# EasyEDA schematic Talos ES™ CTRL Schematics.json

## Sheets
1 FETCH: TITLE: Talos ES™ CTRL, fetch; REV: 1.0; Date: 2022-12-02; Sheet: 1/6; Drawn By: Bernardo Kastrup; Company: The Byte Attic
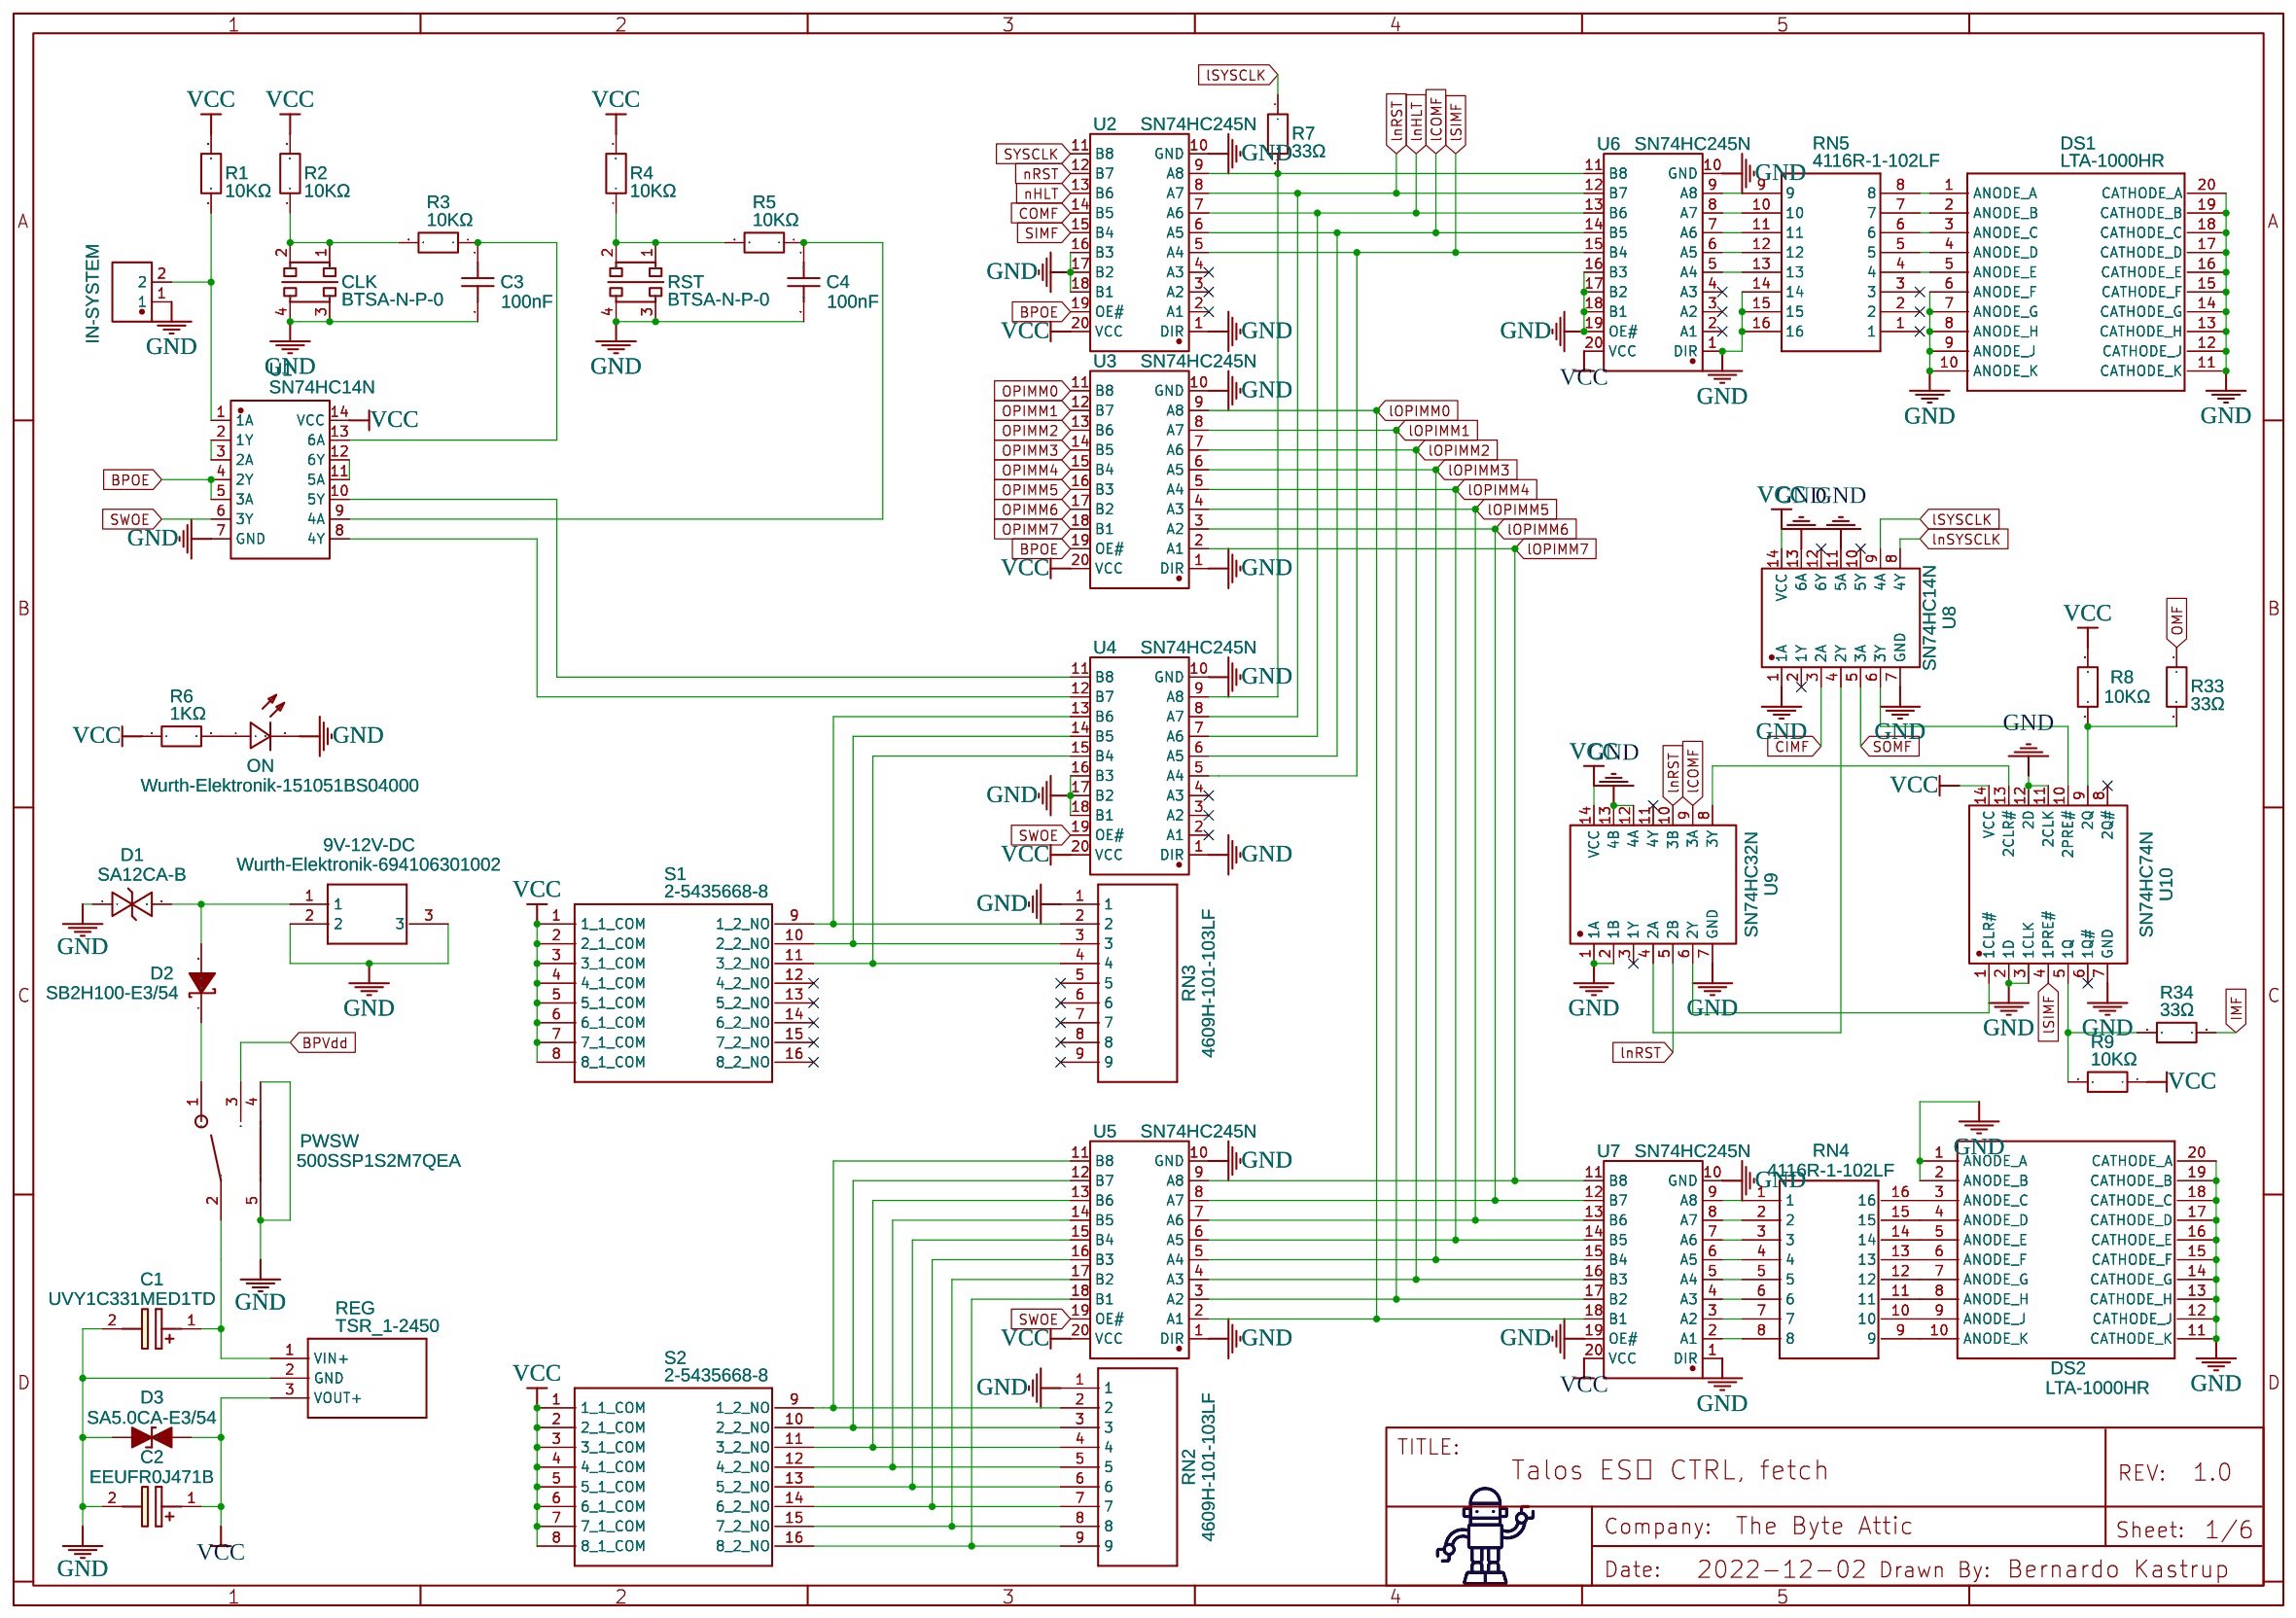
[diagram p0: FETCH]
2 HALT: TITLE: Talos ES™ CTRL, halt circuitry; Sheet: 2/6
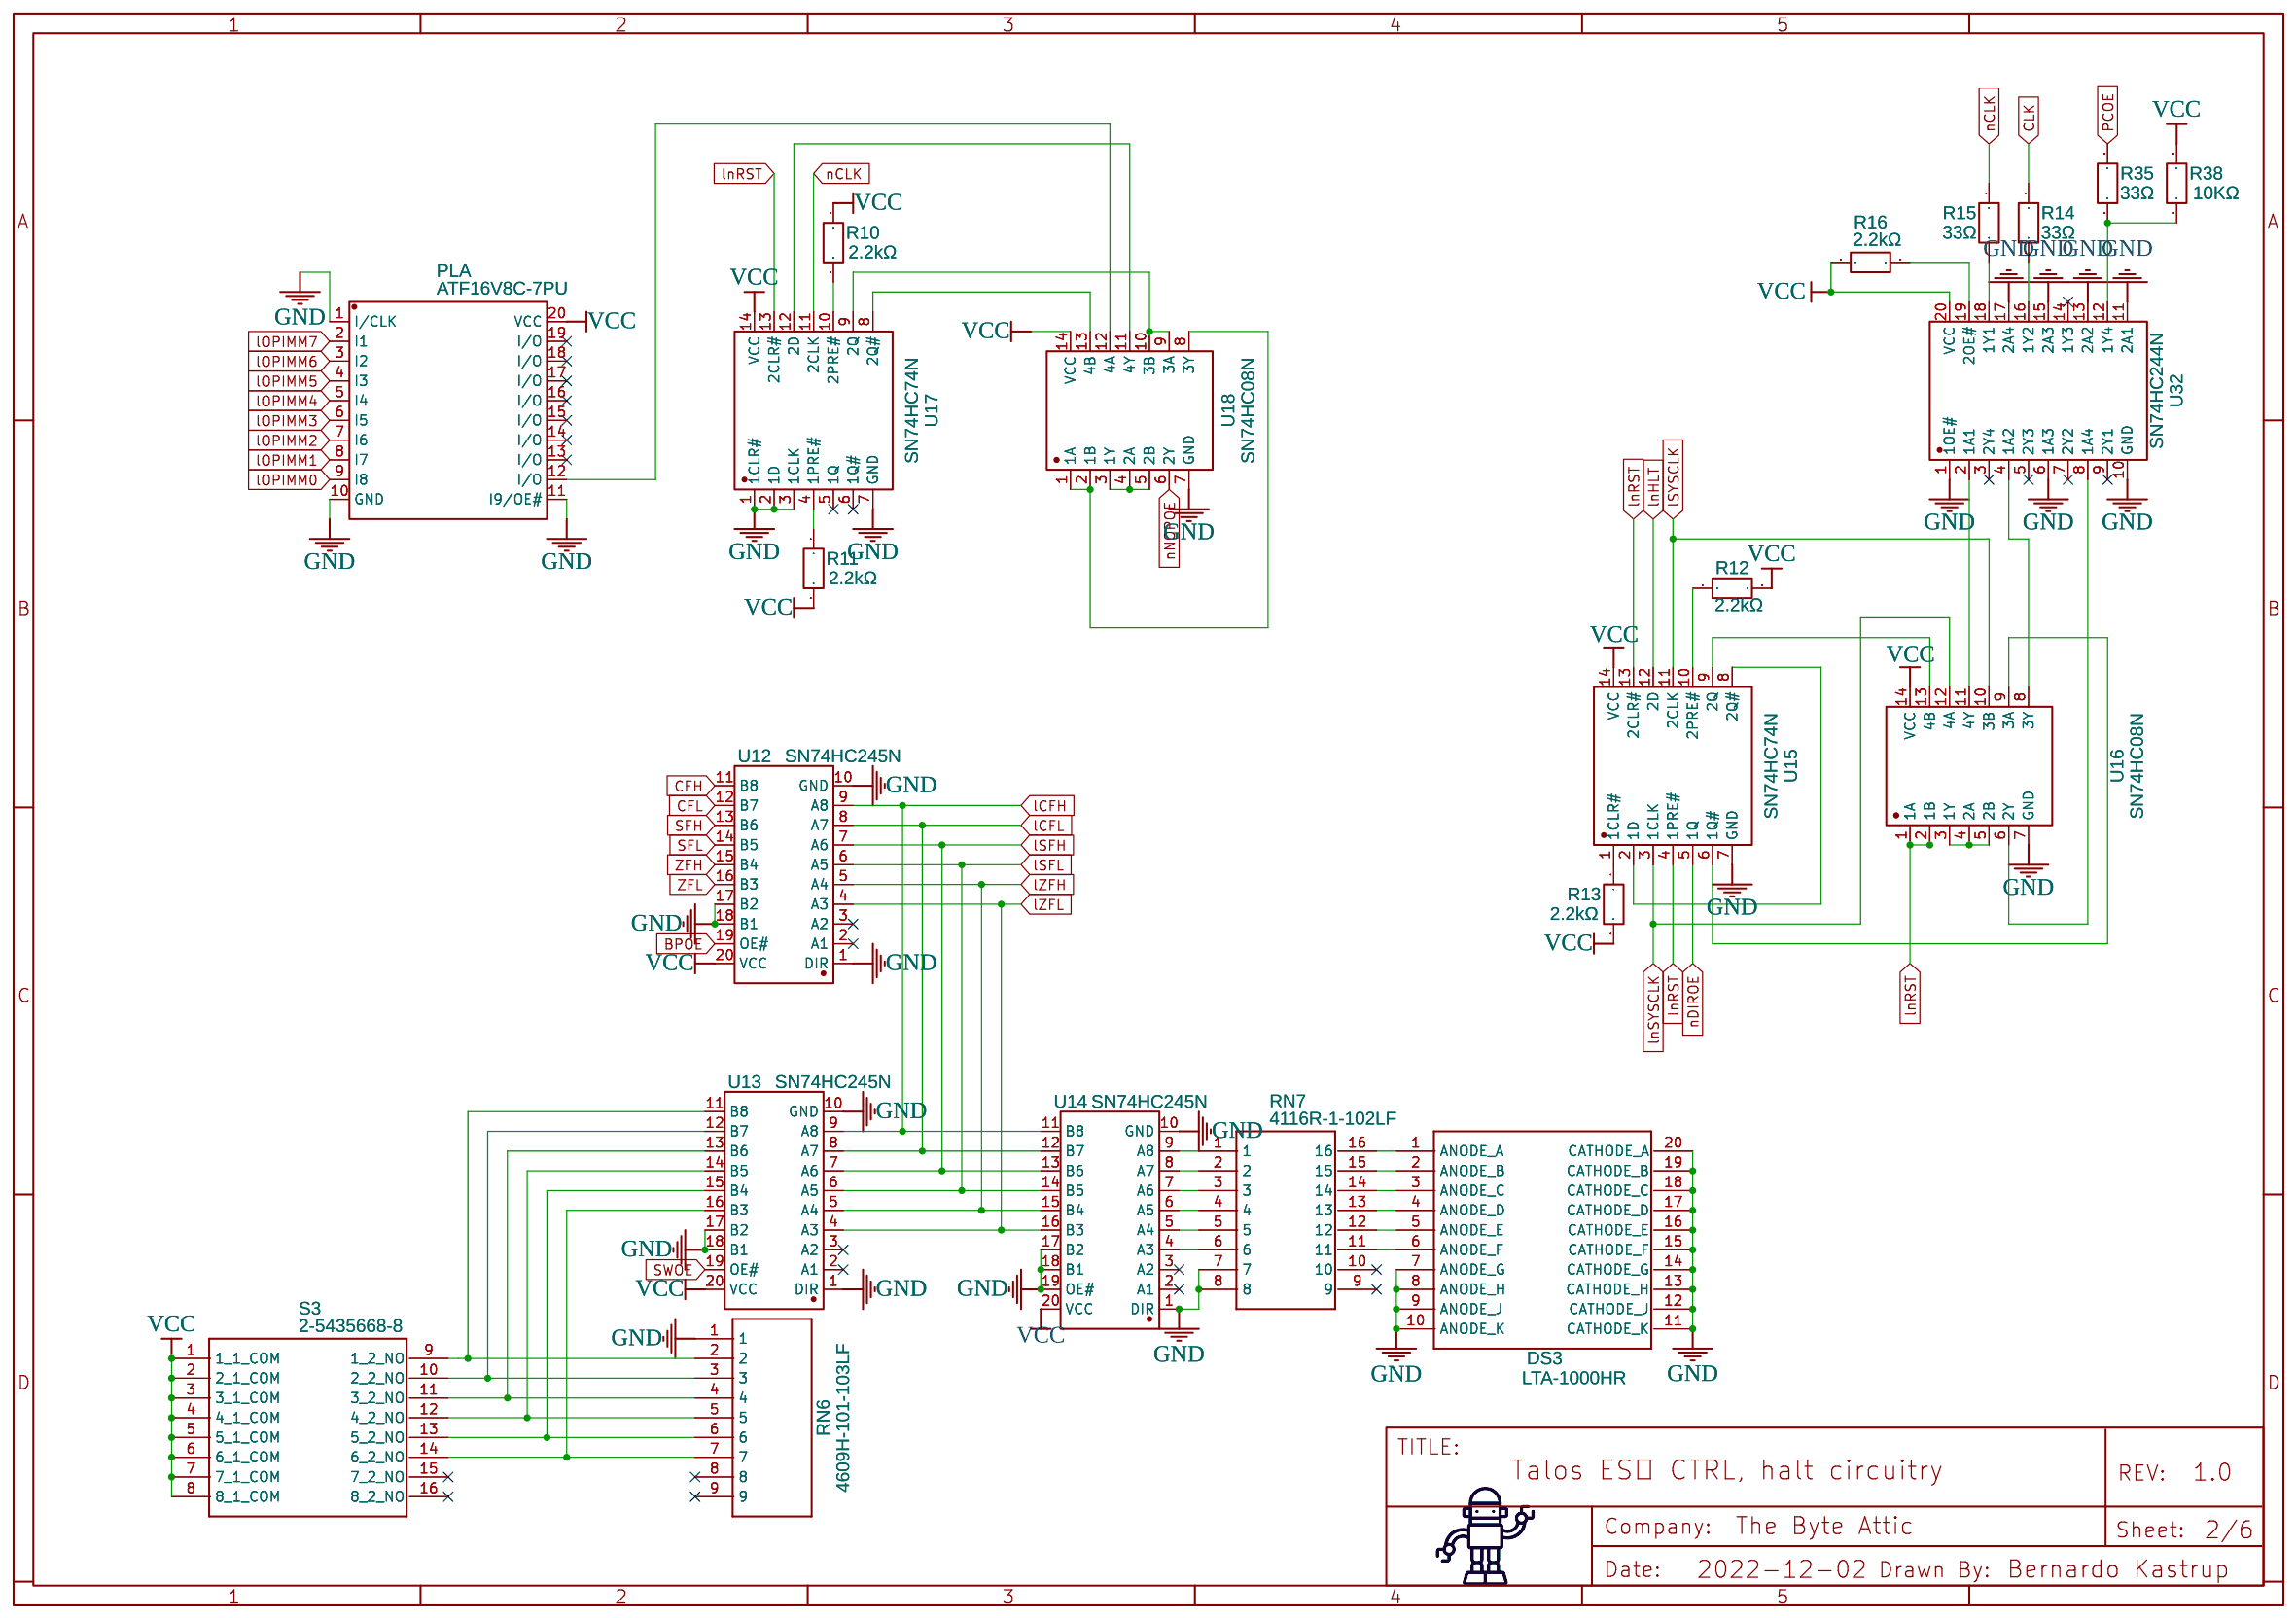
[diagram p1: HALT]
3 DECODE: TITLE: Talos ES™ CTRL, decode; Sheet: 3/6
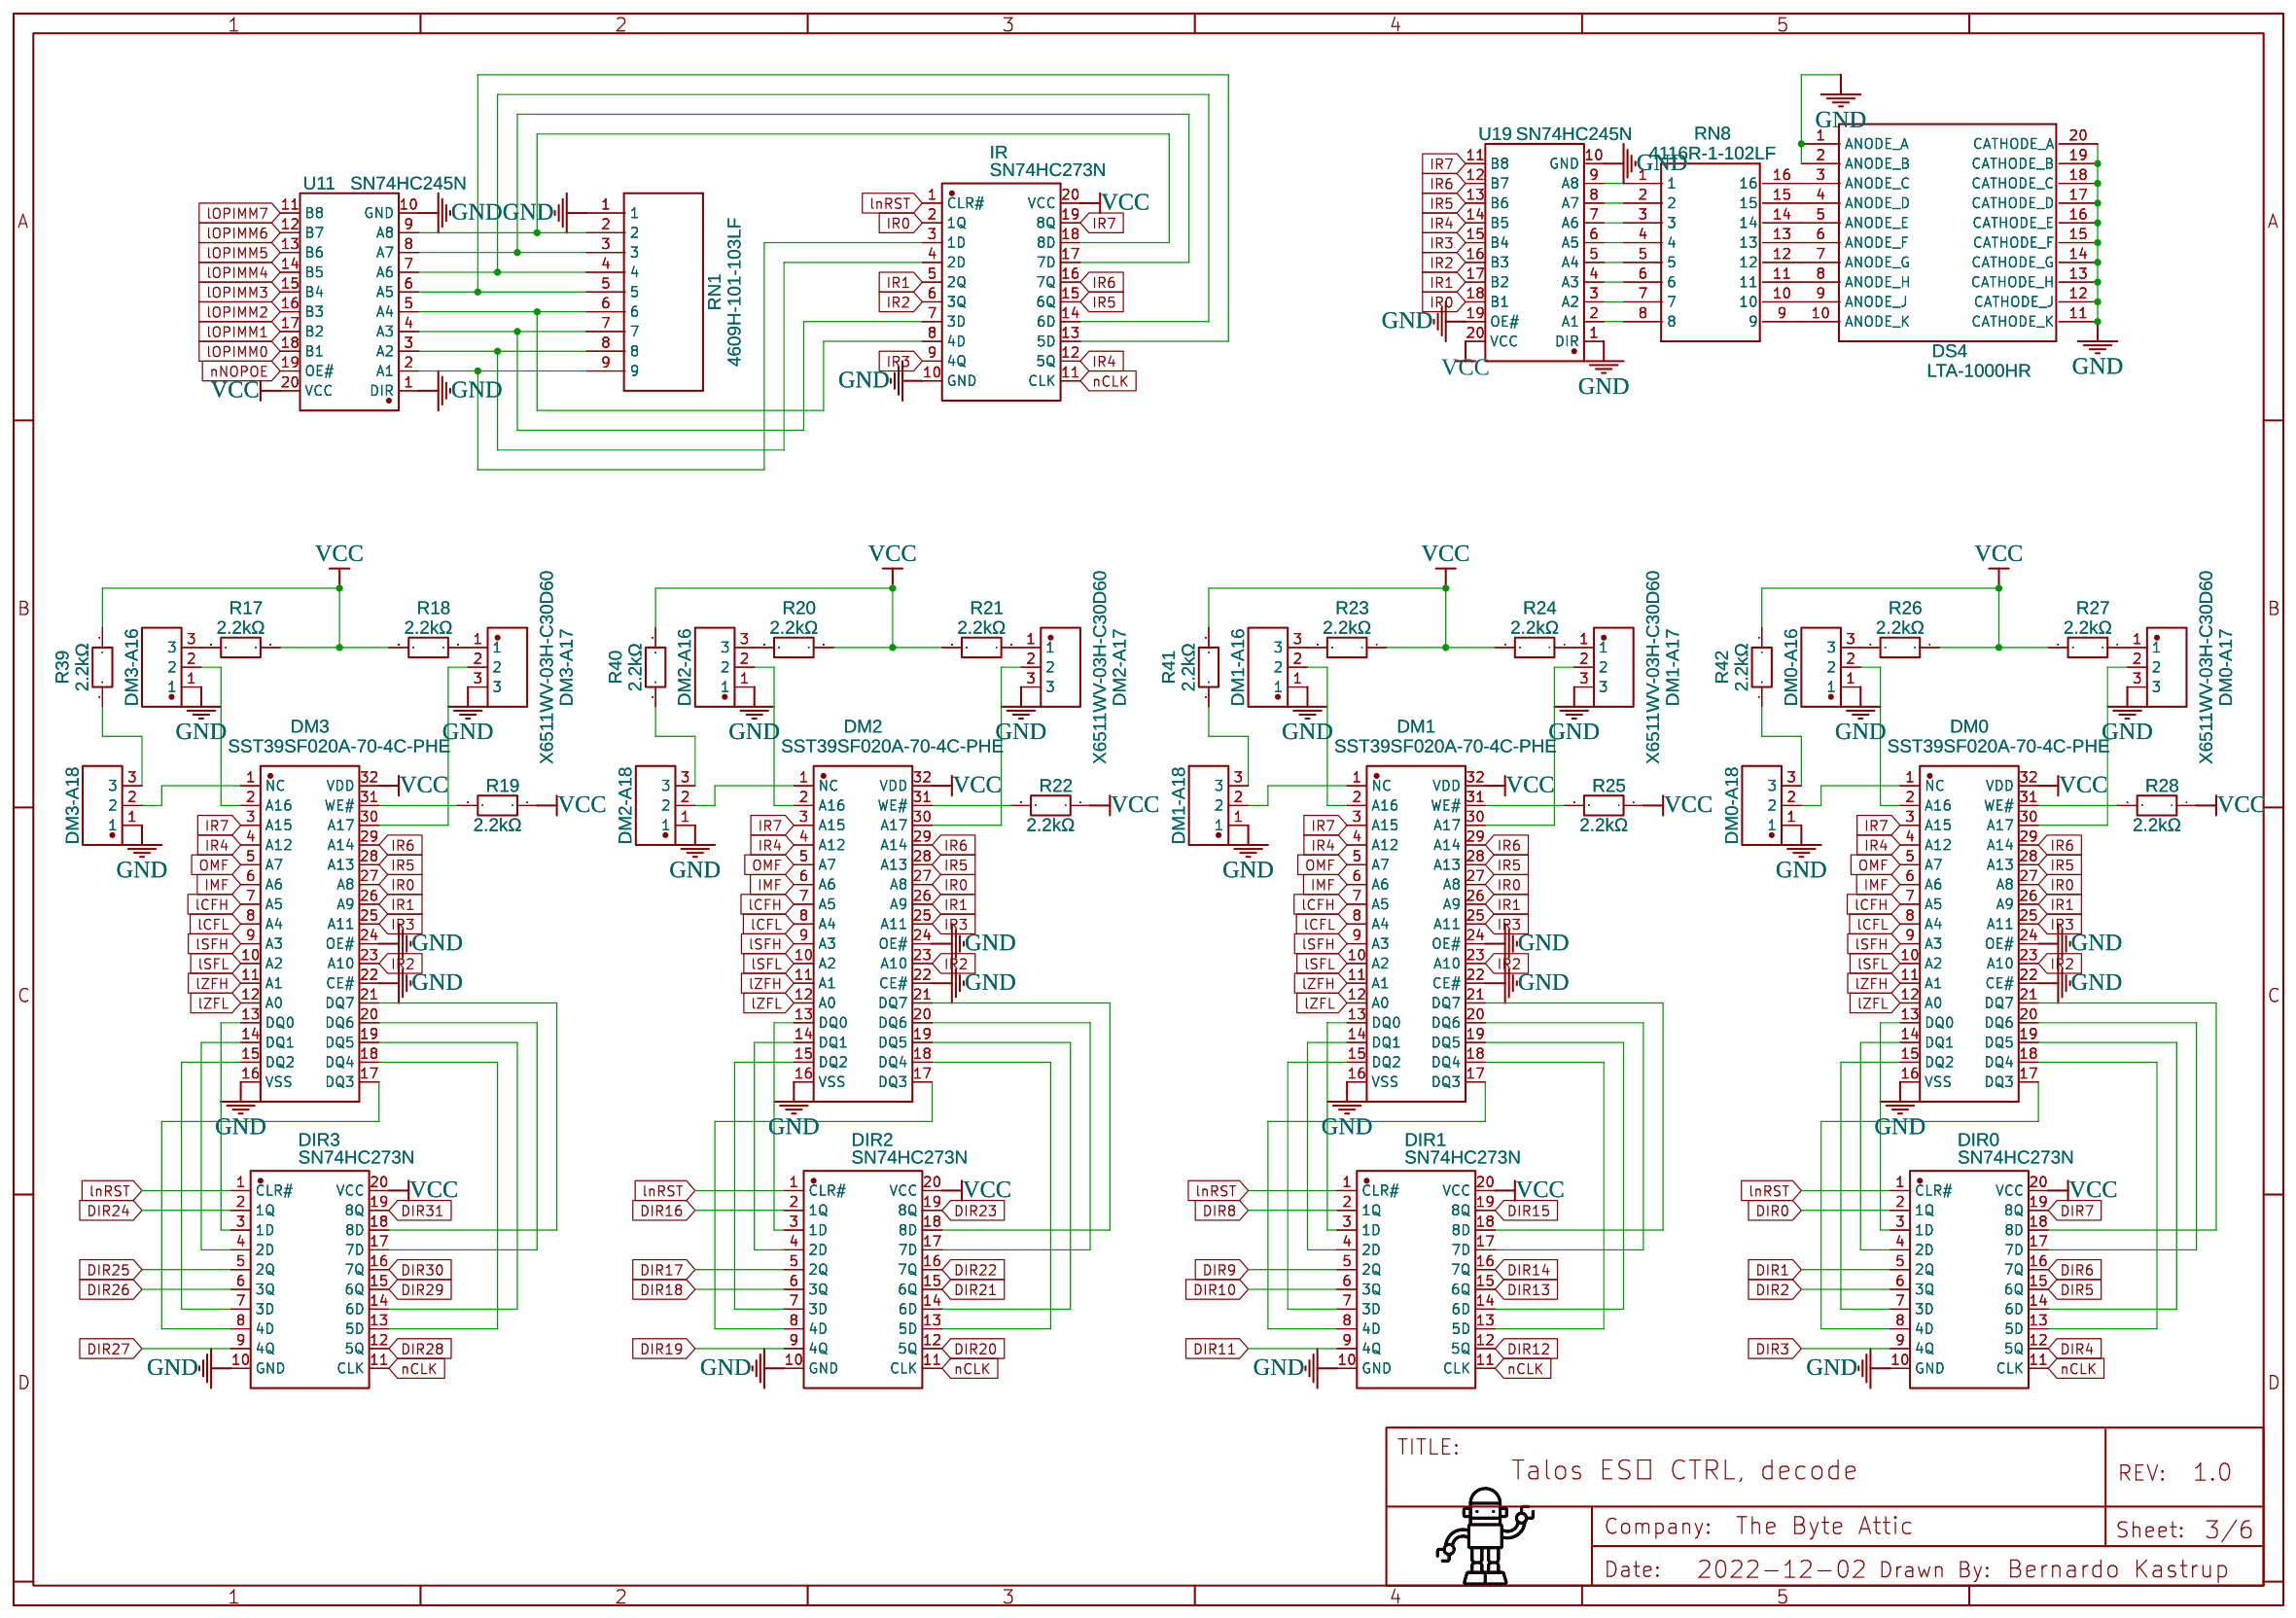
[diagram p2: DECODE]
4 EXECUTE: TITLE: Talos ES™ CTRL, execute; Sheet: 4/6
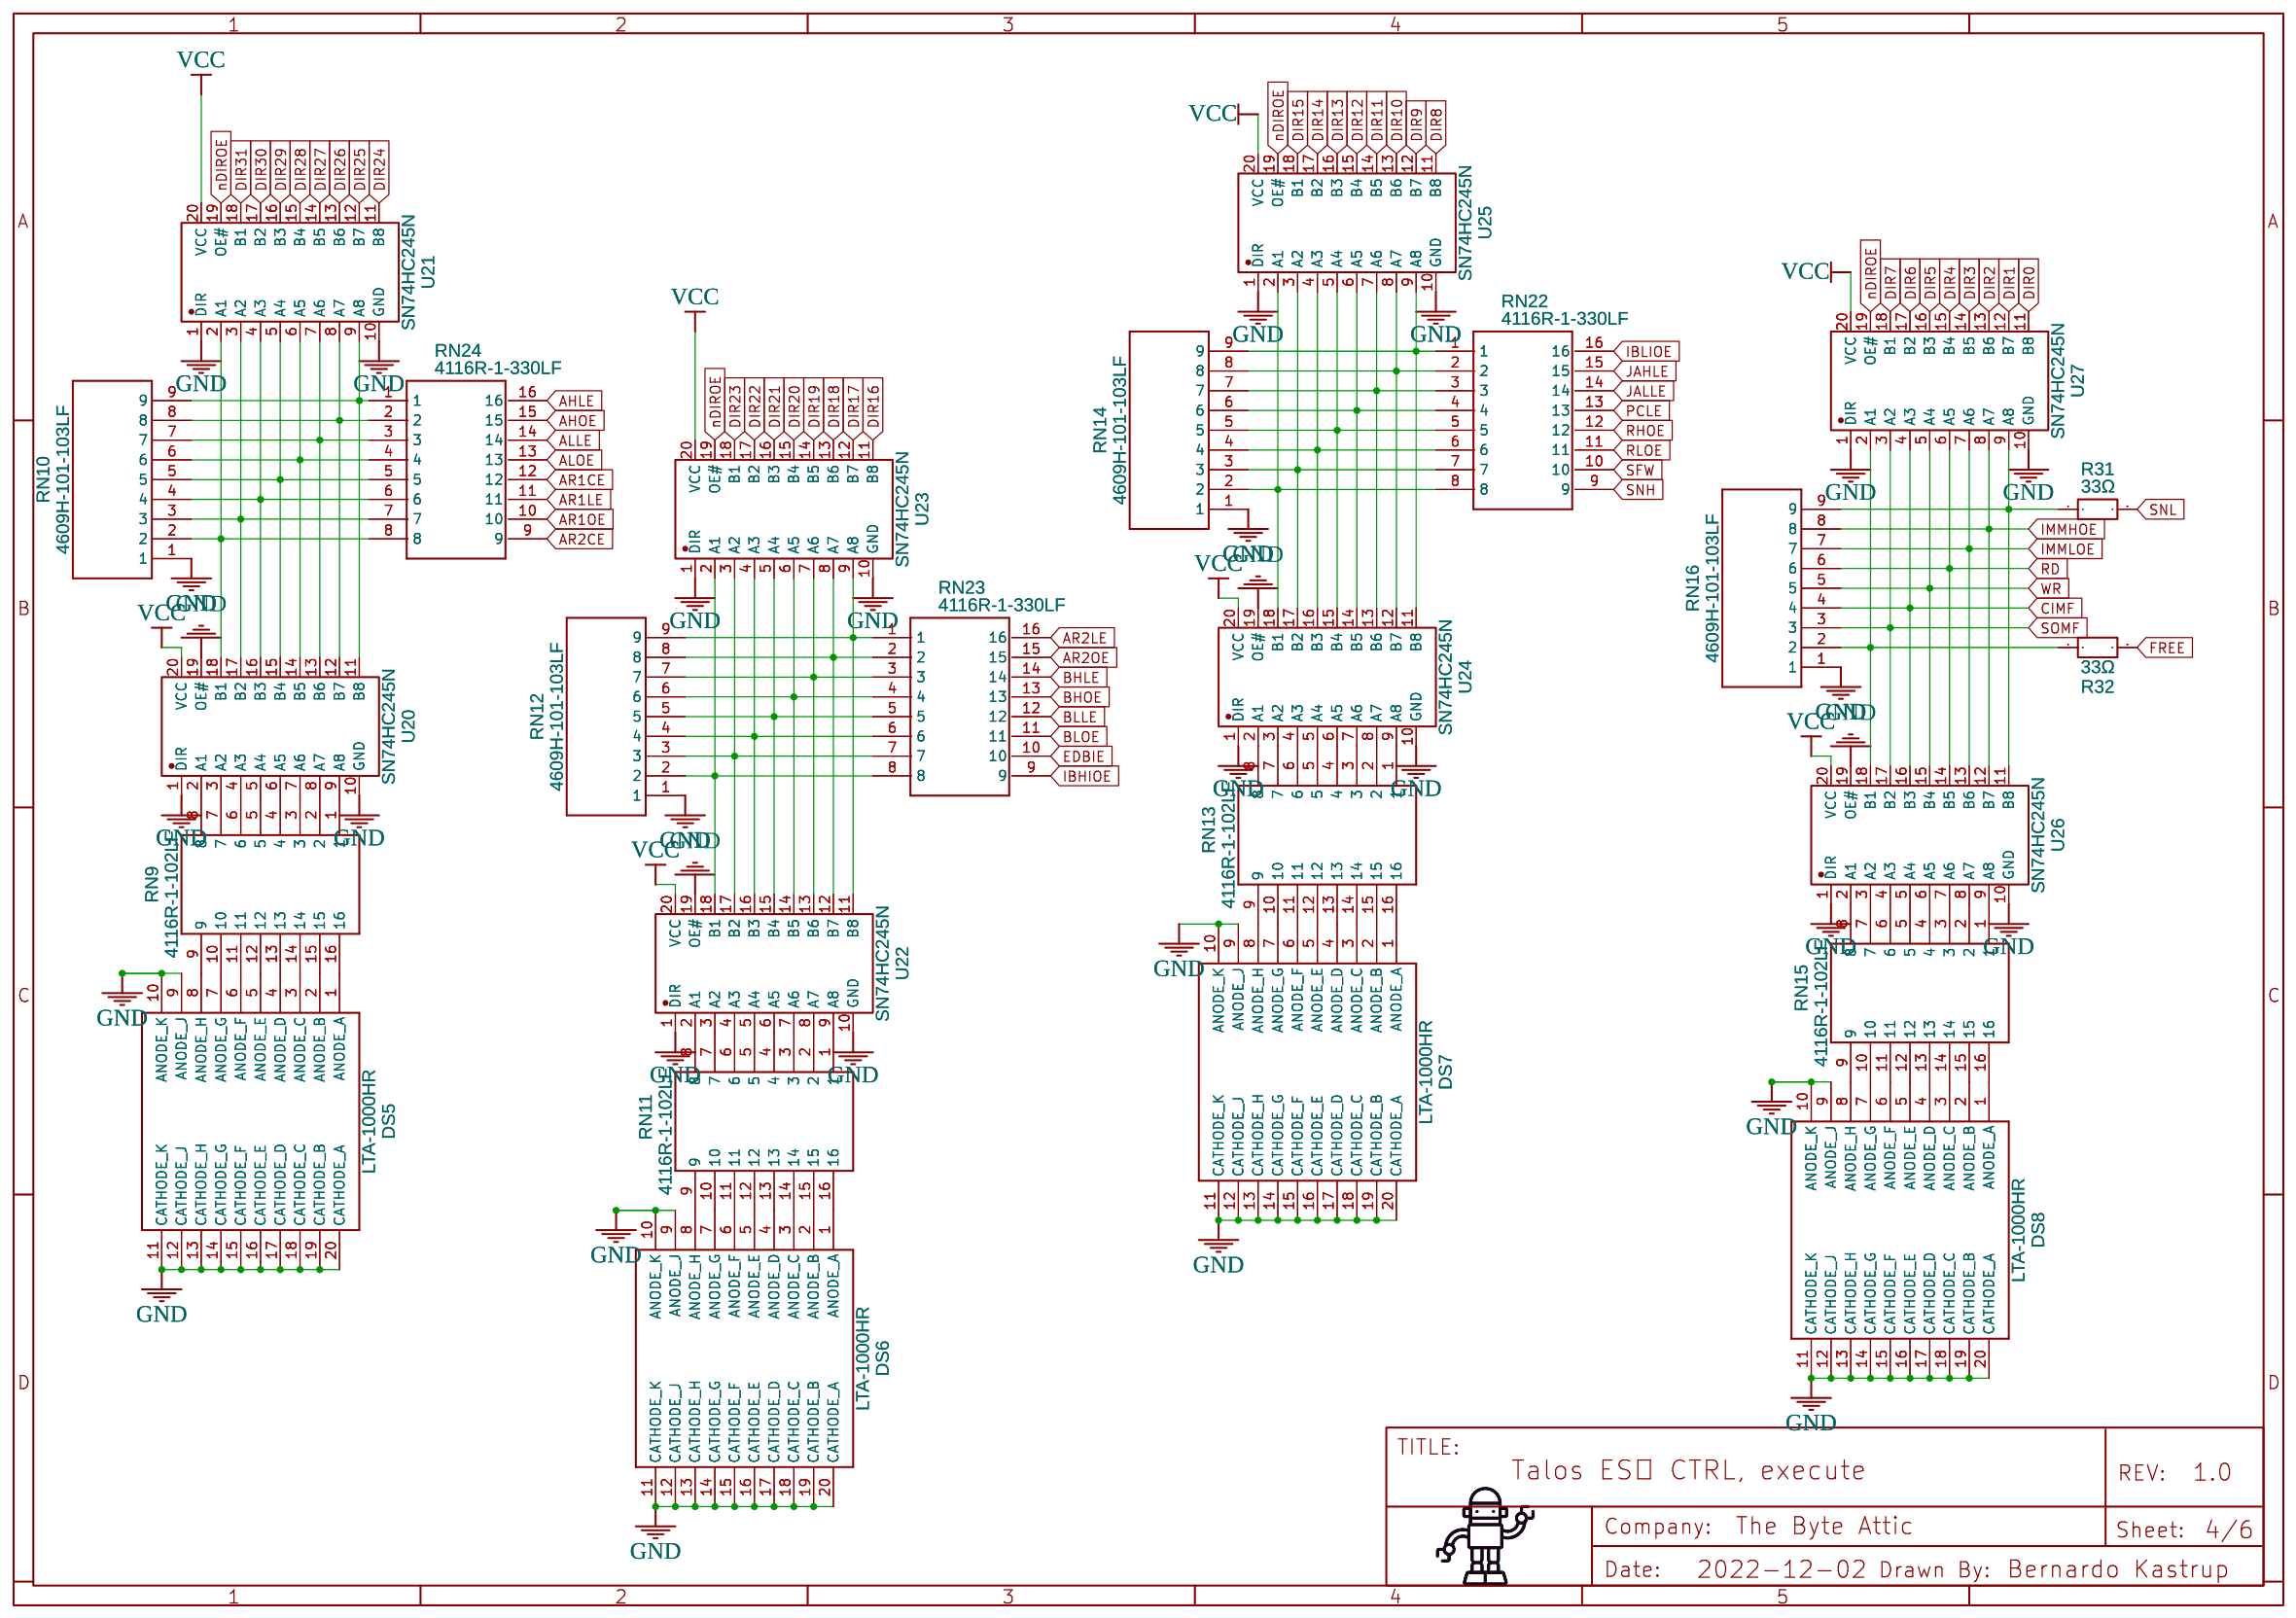
[diagram p3: EXECUTE]
5 IMMEDIATE: TITLE: Talos ES™ CTRL, immediate handling; Sheet: 5/6
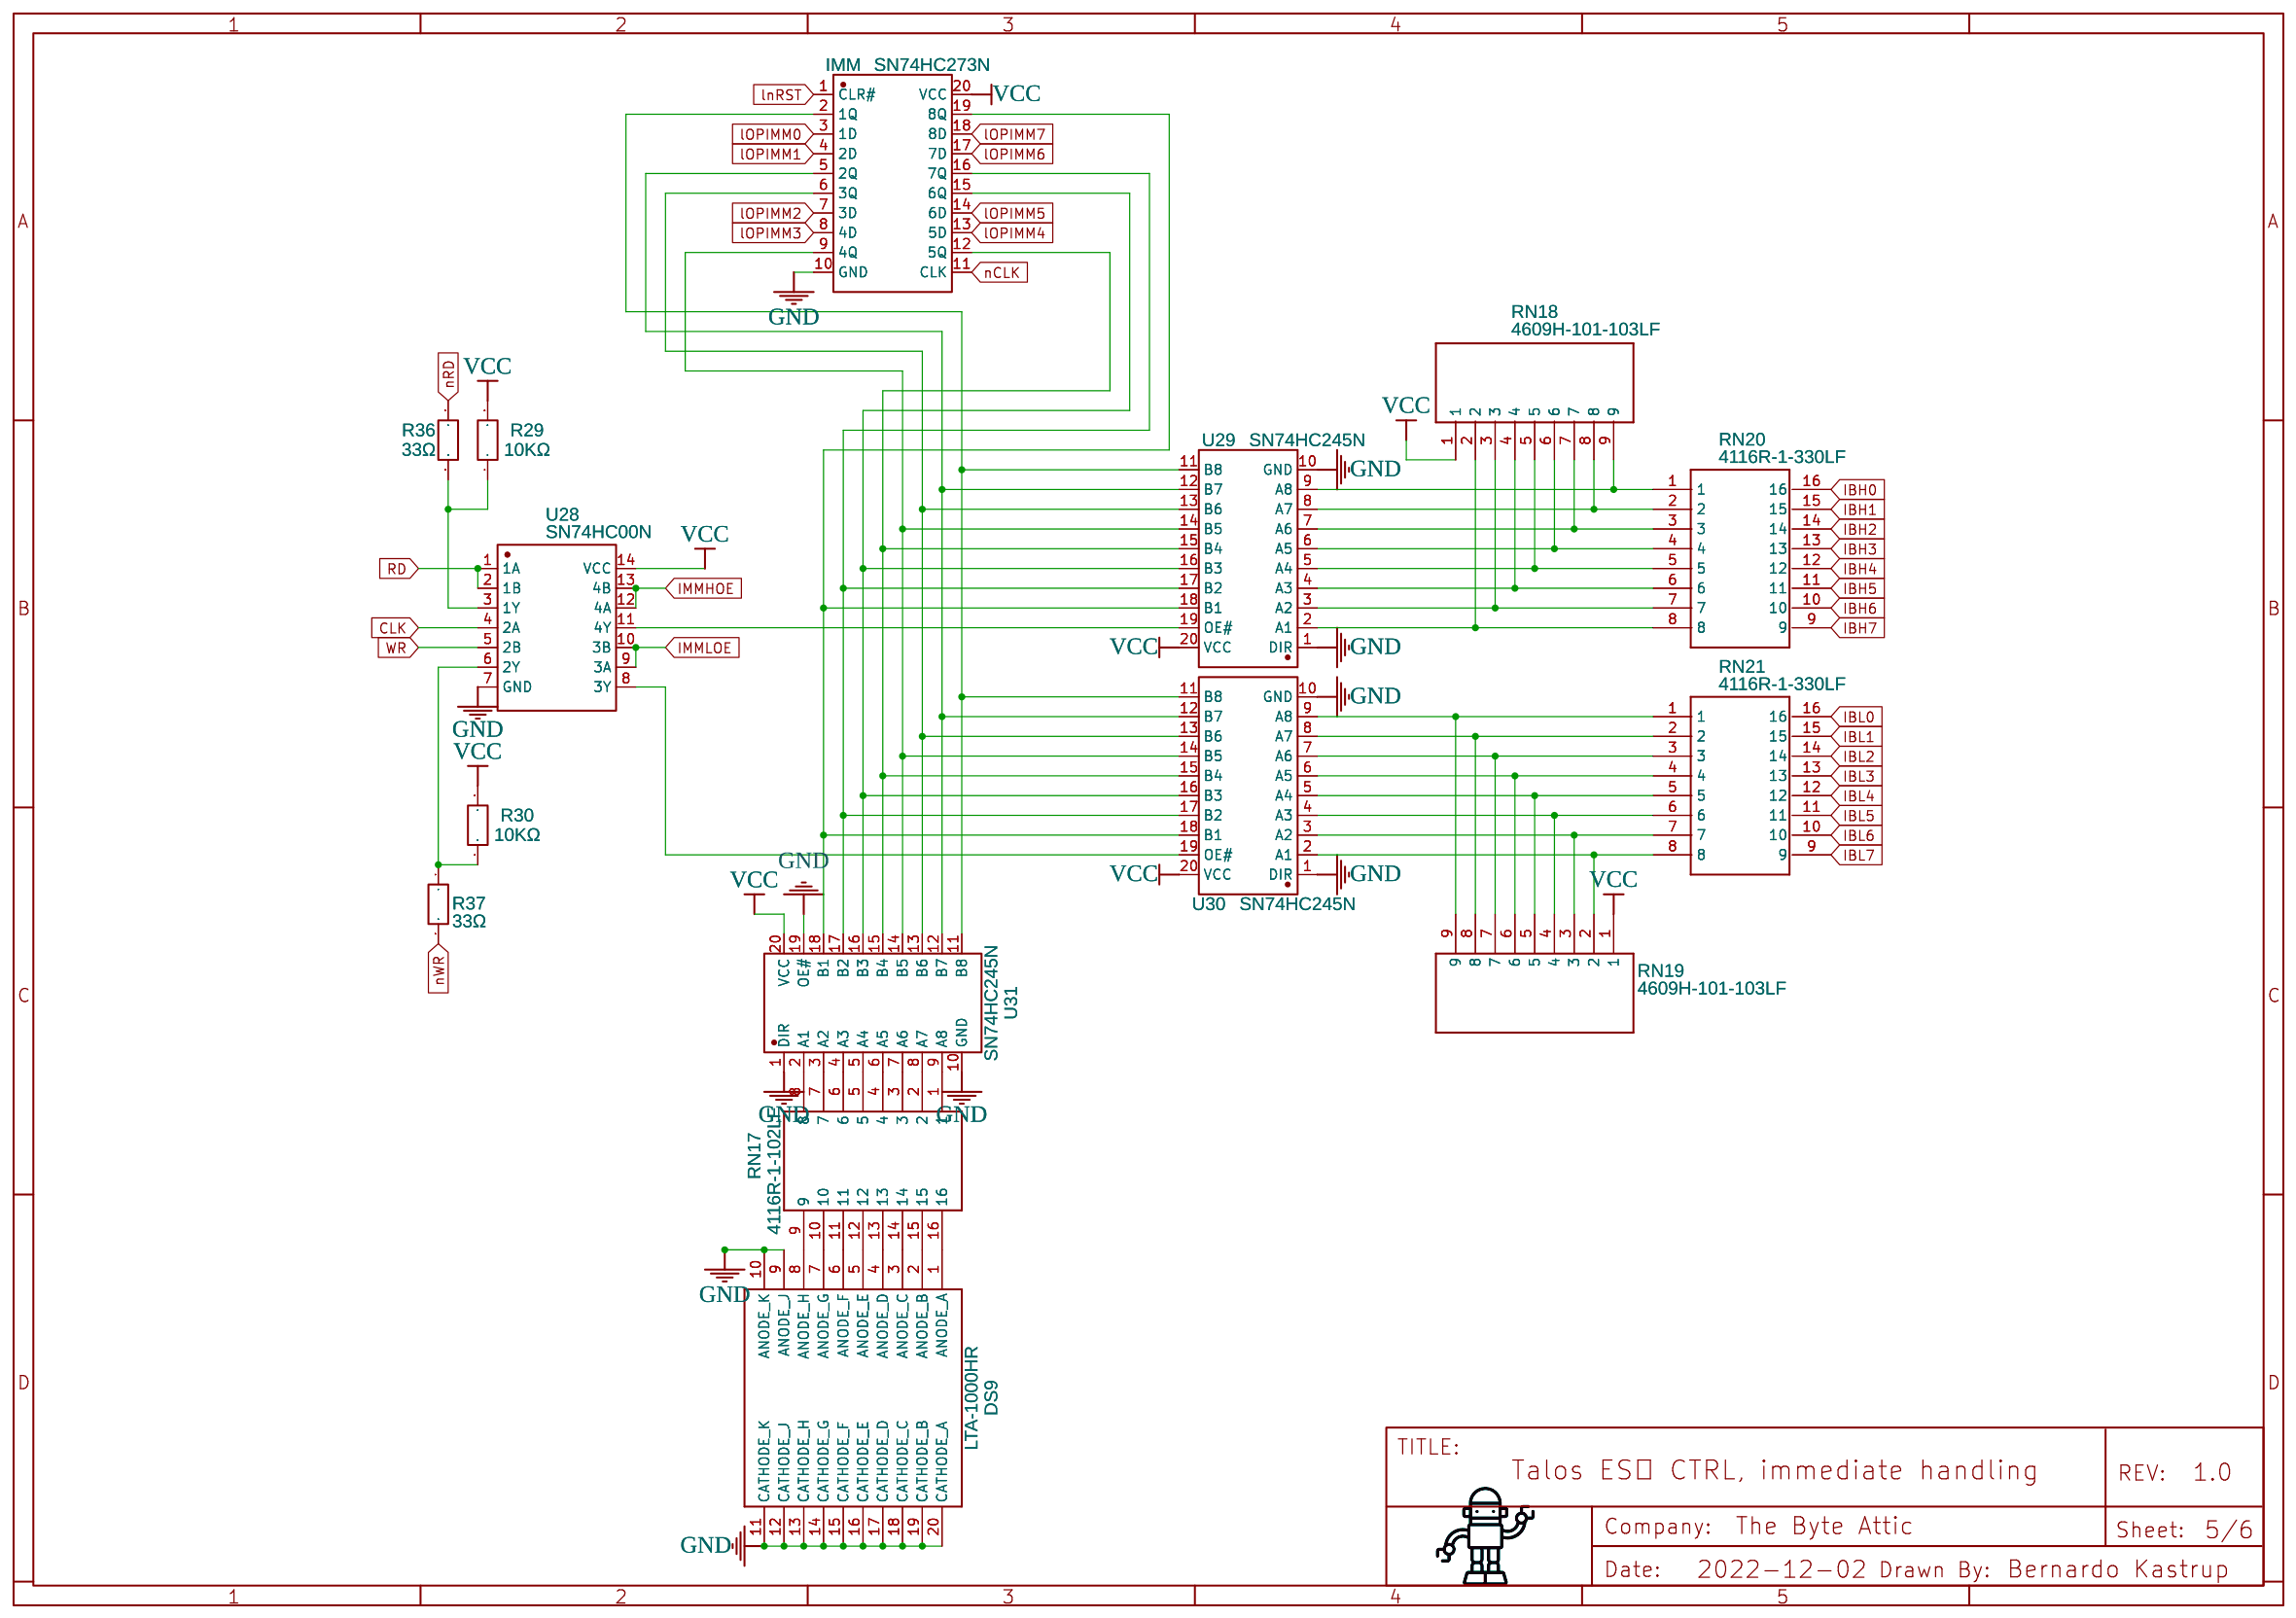
[diagram p4: IMMEDIATE]
6 I/O: TITLE: Talos ES™ CTRL, I/Os; Sheet: 6/6
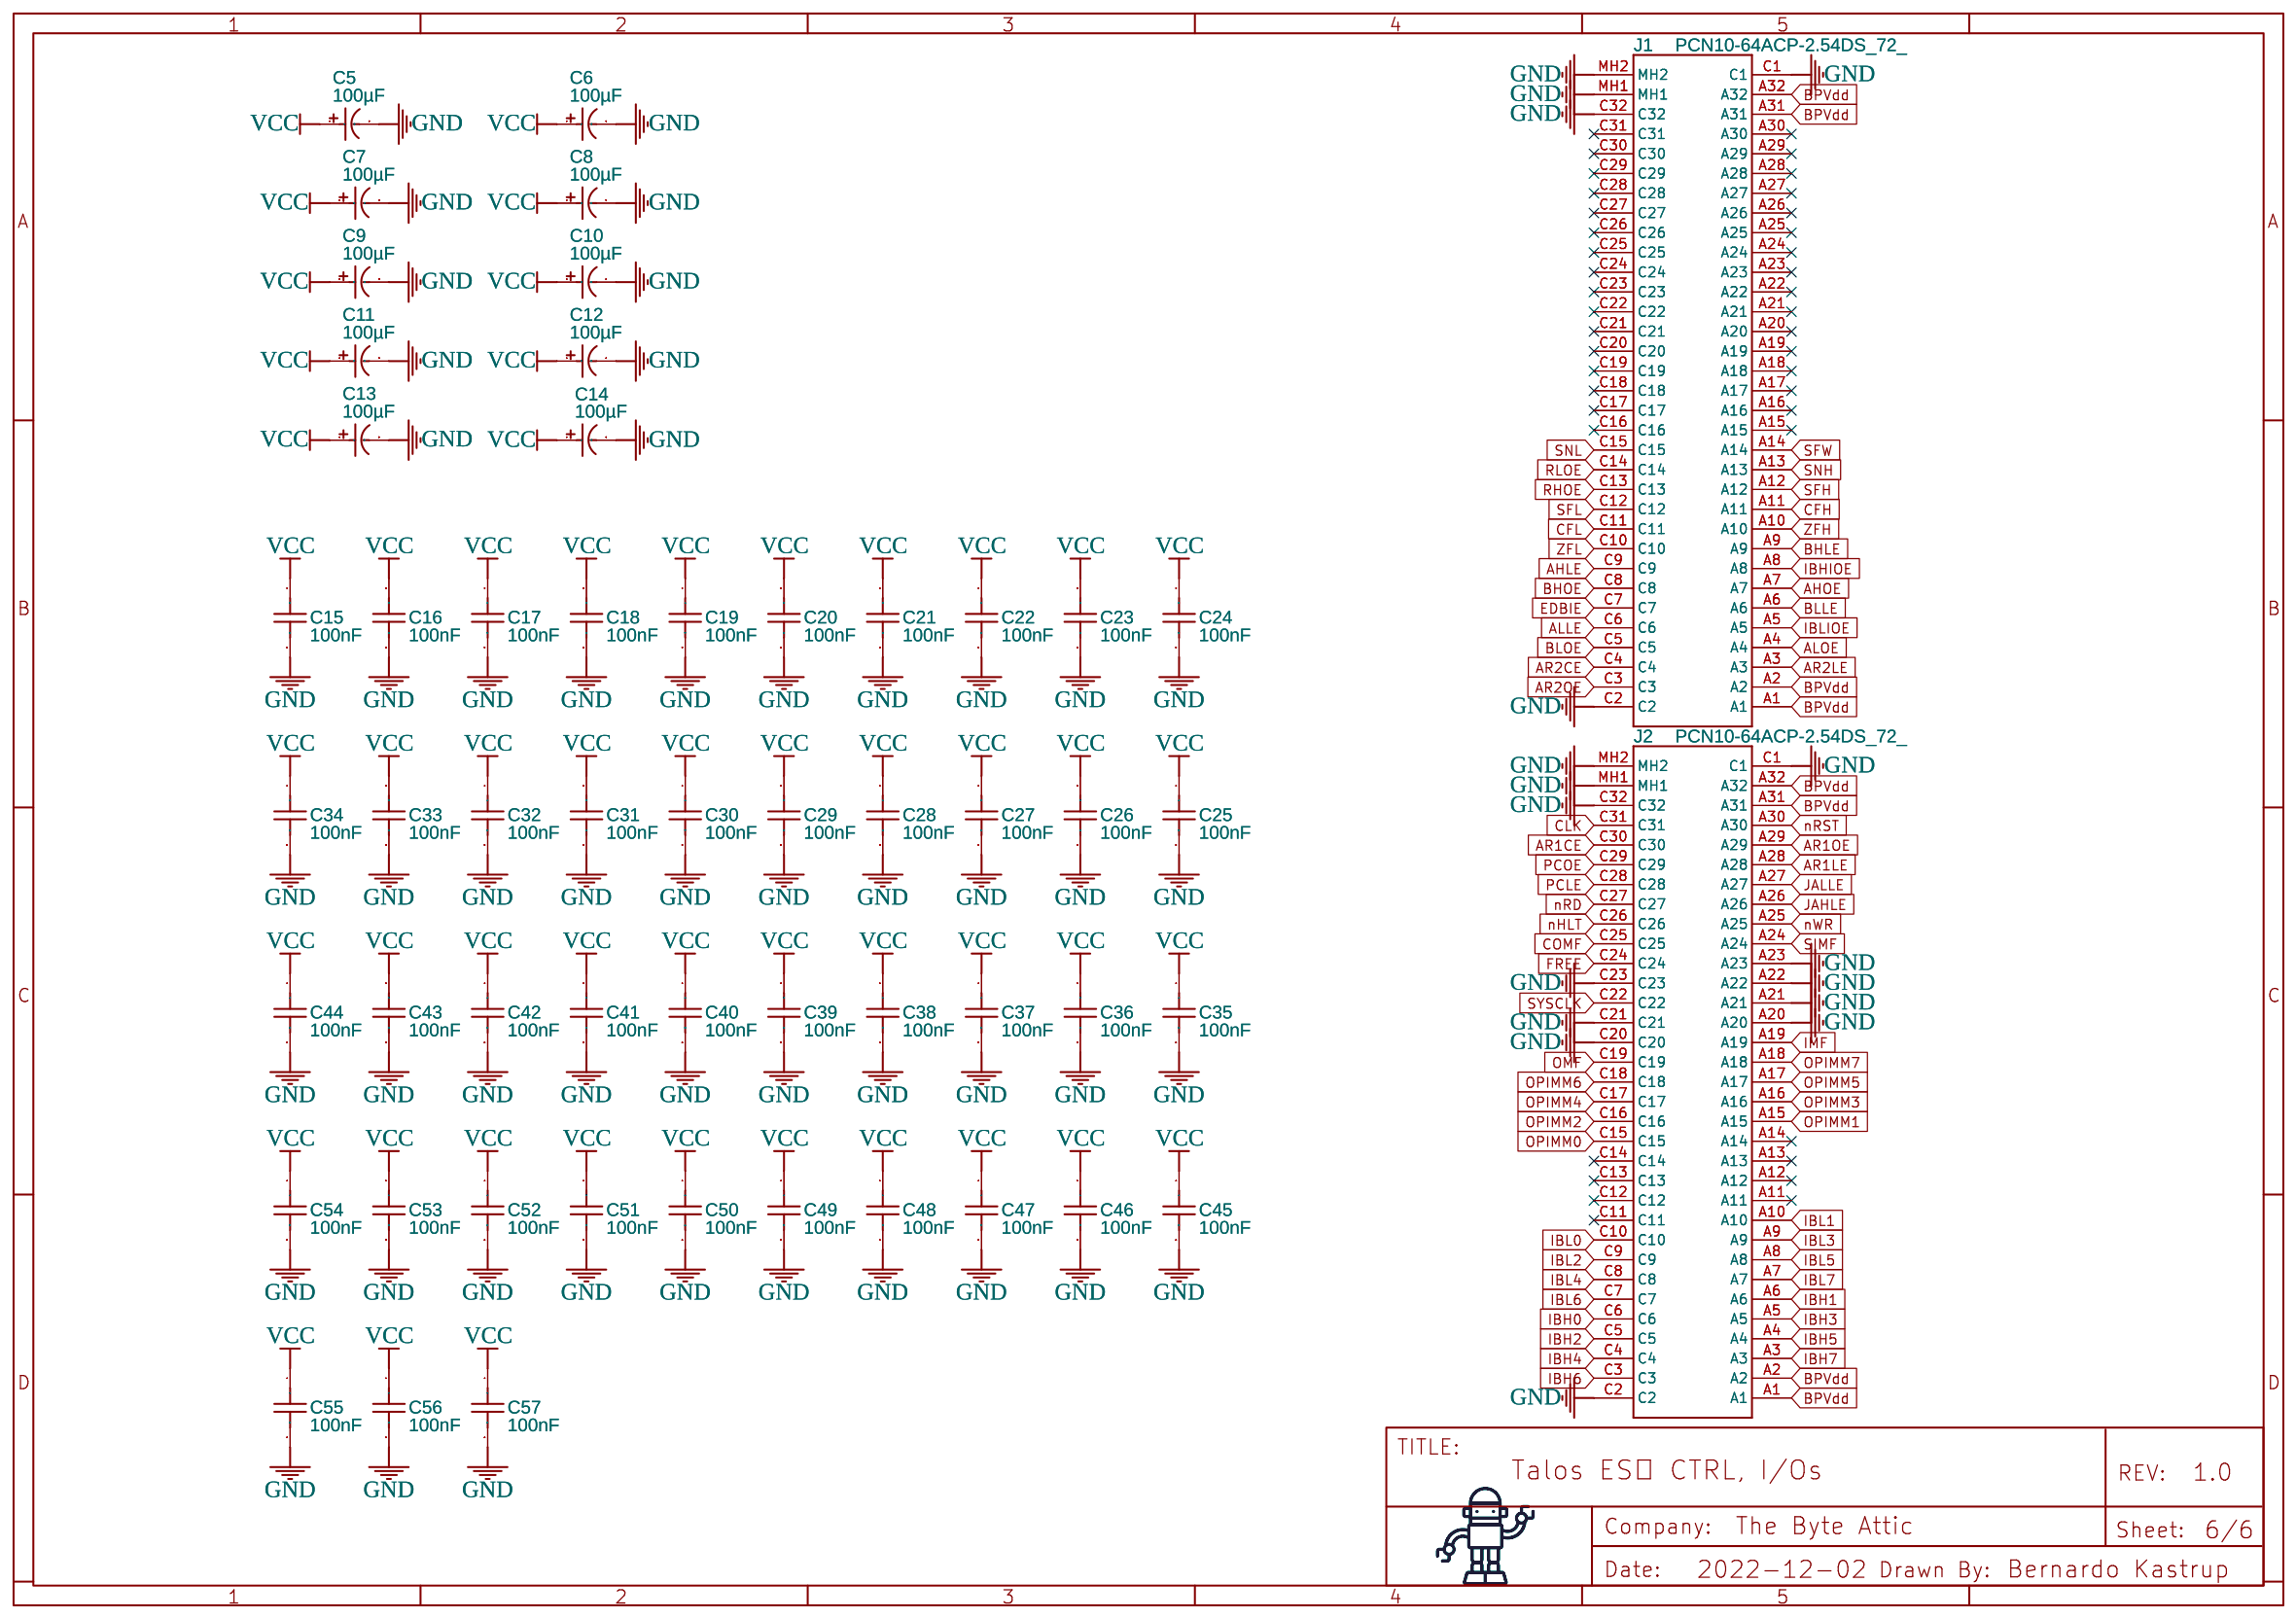
[diagram p5: I/O]

## Parts
sheet DECODE
DIR0  SN74HC273N  [DIP-20_L26.8-W6.4-P2.54-LS7.6-BL]
DIR1  SN74HC273N  [DIP-20_L26.8-W6.4-P2.54-LS7.6-BL]
DIR2  SN74HC273N  [DIP-20_L26.8-W6.4-P2.54-LS7.6-BL]
DIR3  SN74HC273N  [DIP-20_L26.8-W6.4-P2.54-LS7.6-BL]
DM0  SST39SF020A-70-4C-PHE  [PDIP-32_L42.0-W13.7-P2.54-LS15.2-BL]
DM0-A16  X6511WV-03H-C30D60  [HDR-TH_3P-P2.54-V-M]
DM0-A17  X6511WV-03H-C30D60  [HDR-TH_3P-P2.54-V-M]
DM0-A18  X6511WV-03H-C30D60  [HDR-TH_3P-P2.54-V-M]
DM1  SST39SF020A-70-4C-PHE  [PDIP-32_L42.0-W13.7-P2.54-LS15.2-BL]
DM1-A16  X6511WV-03H-C30D60  [HDR-TH_3P-P2.54-V-M]
DM1-A17  X6511WV-03H-C30D60  [HDR-TH_3P-P2.54-V-M]
DM1-A18  X6511WV-03H-C30D60  [HDR-TH_3P-P2.54-V-M]
DM2  SST39SF020A-70-4C-PHE  [PDIP-32_L42.0-W13.7-P2.54-LS15.2-BL]
DM2-A16  X6511WV-03H-C30D60  [HDR-TH_3P-P2.54-V-M]
DM2-A17  X6511WV-03H-C30D60  [HDR-TH_3P-P2.54-V-M]
DM2-A18  X6511WV-03H-C30D60  [HDR-TH_3P-P2.54-V-M]
DM3  SST39SF020A-70-4C-PHE  [PDIP-32_L42.0-W13.7-P2.54-LS15.2-BL]
DM3-A16  X6511WV-03H-C30D60  [HDR-TH_3P-P2.54-V-M]
DM3-A17  X6511WV-03H-C30D60  [HDR-TH_3P-P2.54-V-M]
DM3-A18  X6511WV-03H-C30D60  [HDR-TH_3P-P2.54-V-M]
DS4  LTA-1000HR  [DIPS762W50P254L2527H825Q20N]
IR  SN74HC273N  [DIP-20_L26.8-W6.4-P2.54-LS7.6-BL]
R17  2.2kΩ  [RES-TH_BD2.3-L6.5-P10.50-D0.5]
R18  2.2kΩ  [RES-TH_BD2.3-L6.5-P10.50-D0.5]
R19  2.2kΩ  [RES-TH_BD2.3-L6.5-P10.50-D0.5]
R20  2.2kΩ  [RES-TH_BD2.3-L6.5-P10.50-D0.5]
R21  2.2kΩ  [RES-TH_BD2.3-L6.5-P10.50-D0.5]
R22  2.2kΩ  [RES-TH_BD2.3-L6.5-P10.50-D0.5]
R23  2.2kΩ  [RES-TH_BD2.3-L6.5-P10.50-D0.5]
R24  2.2kΩ  [RES-TH_BD2.3-L6.5-P10.50-D0.5]
R25  2.2kΩ  [RES-TH_BD2.3-L6.5-P10.50-D0.5]
R26  2.2kΩ  [RES-TH_BD2.3-L6.5-P10.50-D0.5]
R27  2.2kΩ  [RES-TH_BD2.3-L6.5-P10.50-D0.5]
R28  2.2kΩ  [RES-TH_BD2.3-L6.5-P10.50-D0.5]
R39  2.2kΩ  [RES-TH_BD2.3-L6.5-P10.50-D0.5]
R40  2.2kΩ  [RES-TH_BD2.3-L6.5-P10.50-D0.5]
R41  2.2kΩ  [RES-TH_BD2.3-L6.5-P10.50-D0.5]
R42  2.2kΩ  [RES-TH_BD2.3-L6.5-P10.50-D0.5]
RN1  4609H-101-103LF  [4609H101103LF]
RN8  4116R-1-102LF  [DIP787W49P254L2197H469Q16N]
U11  SN74HC245N  [DIP-20_L26.8-W6.4-P2.54-LS7.6-BL]
U19  SN74HC245N  [DIP-20_L26.8-W6.4-P2.54-LS7.6-BL]
sheet EXECUTE
DS5  LTA-1000HR  [DIPS762W50P254L2527H825Q20N]
DS6  LTA-1000HR  [DIPS762W50P254L2527H825Q20N]
DS7  LTA-1000HR  [DIPS762W50P254L2527H825Q20N]
DS8  LTA-1000HR  [DIPS762W50P254L2527H825Q20N]
R31  33Ω  [RES-TH_BD2.3-L6.5-P10.50-D0.5]
R32  33Ω  [RES-TH_BD2.3-L6.5-P10.50-D0.5]
RN9  4116R-1-102LF  [DIP787W49P254L2197H469Q16N]
RN10  4609H-101-103LF  [4609H101103LF]
RN11  4116R-1-102LF  [DIP787W49P254L2197H469Q16N]
RN12  4609H-101-103LF  [4609H101103LF]
RN13  4116R-1-102LF  [DIP787W49P254L2197H469Q16N]
RN14  4609H-101-103LF  [4609H101103LF]
RN15  4116R-1-102LF  [DIP787W49P254L2197H469Q16N]
RN16  4609H-101-103LF  [4609H101103LF]
RN22  4116R-1-330LF  [DIP787W49P254L2197H469Q16N]
RN23  4116R-1-330LF  [DIP787W49P254L2197H469Q16N]
RN24  4116R-1-330LF  [DIP787W49P254L2197H469Q16N]
U20  SN74HC245N  [DIP-20_L26.8-W6.4-P2.54-LS7.6-BL]
U21  SN74HC245N  [DIP-20_L26.8-W6.4-P2.54-LS7.6-BL]
U22  SN74HC245N  [DIP-20_L26.8-W6.4-P2.54-LS7.6-BL]
U23  SN74HC245N  [DIP-20_L26.8-W6.4-P2.54-LS7.6-BL]
U24  SN74HC245N  [DIP-20_L26.8-W6.4-P2.54-LS7.6-BL]
U25  SN74HC245N  [DIP-20_L26.8-W6.4-P2.54-LS7.6-BL]
U26  SN74HC245N  [DIP-20_L26.8-W6.4-P2.54-LS7.6-BL]
U27  SN74HC245N  [DIP-20_L26.8-W6.4-P2.54-LS7.6-BL]
sheet FETCH
9V-12V-DC  Wurth-Elektronik-694106301002  [KLDX0202APLT]
C1  UVY1C331MED1TD  [CAPPRD250W55D630H1270]
C2  EEUFR0J471B  [CAPPRD250W55D630H1270]
C3  100nF  [CAP-TH_L3.6-W2.3-P5.00-D0.5]
C4  100nF  [CAP-TH_L3.6-W2.3-P5.00-D0.5]
CLK  BTSA-N-P-0  [SW-TH_BTSA-X-P-0]
D1  SA12CA-B  [DO-15_BD3.1-L6.7-P10.70-D0.8-BI]
D2  SB2H100-E3/54  [DO-15_BD3.1-L6.7-P10.70-D0.9-RD]
D3  SA5.0CA-E3/54  [DO-15_BD3.4-L6.4-P10.35-D0.8-BI]
DS1  LTA-1000HR  [DIPS762W50P254L2527H825Q20N]
DS2  LTA-1000HR  [DIPS762W50P254L2527H825Q20N]
IN-SYSTEM  22-28-4020  [HDR-TH_2P-P2.54-V-M-1]
ON  Wurth-Elektronik-151051BS04000  [LED-TH_BD3.0-P2.54-FD]
PWSW  500SSP1S2M7QEA  [SW-TH_500SSP1S2M7QEA]
R1  10KΩ  [RES-TH_BD2.3-L6.5-P10.50-D0.5]
R2  10KΩ  [RES-TH_BD2.3-L6.5-P10.50-D0.5]
R3  10KΩ  [RES-TH_BD2.3-L6.5-P10.50-D0.5]
R4  10KΩ  [RES-TH_BD2.3-L6.5-P10.50-D0.5]
R5  10KΩ  [RES-TH_BD2.3-L6.5-P10.50-D0.5]
R6  1KΩ  [RES-TH_BD2.3-L6.3-P10.30-D0.6]
R7  33Ω  [RES-TH_BD2.3-L6.5-P10.50-D0.5]
R8  10KΩ  [RES-TH_BD2.3-L6.5-P10.50-D0.5]
R9  10KΩ  [RES-TH_BD2.3-L6.5-P10.50-D0.5]
R33  33Ω  [RES-TH_BD2.3-L6.5-P10.50-D0.5]
R34  33Ω  [RES-TH_BD2.3-L6.5-P10.50-D0.5]
REG  TSR_1-2450  [TSR-1-24120]
RN2  4609H-101-103LF  [4609H101103LF]
RN3  4609H-101-103LF  [4609H101103LF]
RN4  4116R-1-102LF  [DIP787W49P254L2197H469Q16N]
RN5  4116R-1-102LF  [DIP787W49P254L2197H469Q16N]
RST  BTSA-N-P-0  [SW-TH_BTSA-X-P-0]
S1  2-5435668-8  [254356688]
S2  2-5435668-8  [254356688]
U1  SN74HC14N  [DIP-14_L19.2-W6.6-P2.54-LS10.9-BL]
U2  SN74HC245N  [DIP-20_L26.8-W6.4-P2.54-LS7.6-BL]
U3  SN74HC245N  [DIP-20_L26.8-W6.4-P2.54-LS7.6-BL]
U4  SN74HC245N  [DIP-20_L26.8-W6.4-P2.54-LS7.6-BL]
U5  SN74HC245N  [DIP-20_L26.8-W6.4-P2.54-LS7.6-BL]
U6  SN74HC245N  [DIP-20_L26.8-W6.4-P2.54-LS7.6-BL]
U7  SN74HC245N  [DIP-20_L26.8-W6.4-P2.54-LS7.6-BL]
U8  SN74HC14N  [DIP-14_L19.2-W6.6-P2.54-LS10.9-BL]
U9  SN74HC32N  [DIP-14_L19.0-W7.0-P2.54-LS7.6-BL]
U10  SN74HC74N  [PDIP-14_L19.3-W6.4-P2.54-LS7.6-BL]
sheet HALT
DS3  LTA-1000HR  [DIPS762W50P254L2527H825Q20N]
PLA  ATF16V8C-7PU  [DIP-20_L25.4-W7.1-P2.54-LS8.5-BL]
R10  2.2kΩ  [RES-TH_BD2.3-L6.5-P10.50-D0.5]
R11  2.2kΩ  [RES-TH_BD2.3-L6.5-P10.50-D0.5]
R12  2.2kΩ  [RES-TH_BD2.3-L6.5-P10.50-D0.5]
R13  2.2kΩ  [RES-TH_BD2.3-L6.5-P10.50-D0.5]
R14  33Ω  [RES-TH_BD2.3-L6.5-P10.50-D0.5]
R15  33Ω  [RES-TH_BD2.3-L6.5-P10.50-D0.5]
R16  2.2kΩ  [RES-TH_BD2.3-L6.5-P10.50-D0.5]
R35  33Ω  [RES-TH_BD2.3-L6.5-P10.50-D0.5]
R38  10KΩ  [RES-TH_BD2.3-L6.5-P10.50-D0.5]
RN6  4609H-101-103LF  [4609H101103LF]
RN7  4116R-1-102LF  [DIP787W49P254L2197H469Q16N]
S3  2-5435668-8  [254356688]
U12  SN74HC245N  [DIP-20_L26.8-W6.4-P2.54-LS7.6-BL]
U13  SN74HC245N  [DIP-20_L26.8-W6.4-P2.54-LS7.6-BL]
U14  SN74HC245N  [DIP-20_L26.8-W6.4-P2.54-LS7.6-BL]
U15  SN74HC74N  [PDIP-14_L19.3-W6.4-P2.54-LS7.6-BL]
U16  SN74HC08N  [DIP-14_L19.2-W6.6-P2.54-LS10.9-BL]
U17  SN74HC74N  [PDIP-14_L19.3-W6.4-P2.54-LS7.6-BL]
U18  SN74HC08N  [DIP-14_L19.2-W6.6-P2.54-LS10.9-BL]
U32  SN74HC244N  [DIP-20_L26.8-W6.4-P2.54-LS7.6-BL]
sheet I/O
C5  100µF  [CAP-TH_BD6.3-P2.50-D1.0-FD]
C6  100µF  [CAP-TH_BD6.3-P2.50-D1.0-FD]
C7  100µF  [CAP-TH_BD6.3-P2.50-D1.0-FD]
C8  100µF  [CAP-TH_BD6.3-P2.50-D1.0-FD]
C9  100µF  [CAP-TH_BD6.3-P2.50-D1.0-FD]
C10  100µF  [CAP-TH_BD6.3-P2.50-D1.0-FD]
C11  100µF  [CAP-TH_BD6.3-P2.50-D1.0-FD]
C12  100µF  [CAP-TH_BD6.3-P2.50-D1.0-FD]
C13  100µF  [CAP-TH_BD6.3-P2.50-D1.0-FD]
C14  100µF  [CAP-TH_BD6.3-P2.50-D1.0-FD]
C15  100nF  [CAP-TH_L3.6-W2.3-P5.00-D0.5]
C16  100nF  [CAP-TH_L3.6-W2.3-P5.00-D0.5]
C17  100nF  [CAP-TH_L3.6-W2.3-P5.00-D0.5]
C18  100nF  [CAP-TH_L3.6-W2.3-P5.00-D0.5]
C19  100nF  [CAP-TH_L3.6-W2.3-P5.00-D0.5]
C20  100nF  [CAP-TH_L3.6-W2.3-P5.00-D0.5]
C21  100nF  [CAP-TH_L3.6-W2.3-P5.00-D0.5]
C22  100nF  [CAP-TH_L3.6-W2.3-P5.00-D0.5]
C23  100nF  [CAP-TH_L3.6-W2.3-P5.00-D0.5]
C24  100nF  [CAP-TH_L3.6-W2.3-P5.00-D0.5]
C25  100nF  [CAP-TH_L3.6-W2.3-P5.00-D0.5]
C26  100nF  [CAP-TH_L3.6-W2.3-P5.00-D0.5]
C27  100nF  [CAP-TH_L3.6-W2.3-P5.00-D0.5]
C28  100nF  [CAP-TH_L3.6-W2.3-P5.00-D0.5]
C29  100nF  [CAP-TH_L3.6-W2.3-P5.00-D0.5]
C30  100nF  [CAP-TH_L3.6-W2.3-P5.00-D0.5]
C31  100nF  [CAP-TH_L3.6-W2.3-P5.00-D0.5]
C32  100nF  [CAP-TH_L3.6-W2.3-P5.00-D0.5]
C33  100nF  [CAP-TH_L3.6-W2.3-P5.00-D0.5]
C34  100nF  [CAP-TH_L3.6-W2.3-P5.00-D0.5]
C35  100nF  [CAP-TH_L3.6-W2.3-P5.00-D0.5]
C36  100nF  [CAP-TH_L3.6-W2.3-P5.00-D0.5]
C37  100nF  [CAP-TH_L3.6-W2.3-P5.00-D0.5]
C38  100nF  [CAP-TH_L3.6-W2.3-P5.00-D0.5]
C39  100nF  [CAP-TH_L3.6-W2.3-P5.00-D0.5]
C40  100nF  [CAP-TH_L3.6-W2.3-P5.00-D0.5]
C41  100nF  [CAP-TH_L3.6-W2.3-P5.00-D0.5]
C42  100nF  [CAP-TH_L3.6-W2.3-P5.00-D0.5]
C43  100nF  [CAP-TH_L3.6-W2.3-P5.00-D0.5]
C44  100nF  [CAP-TH_L3.6-W2.3-P5.00-D0.5]
C45  100nF  [CAP-TH_L3.6-W2.3-P5.00-D0.5]
C46  100nF  [CAP-TH_L3.6-W2.3-P5.00-D0.5]
C47  100nF  [CAP-TH_L3.6-W2.3-P5.00-D0.5]
C48  100nF  [CAP-TH_L3.6-W2.3-P5.00-D0.5]
C49  100nF  [CAP-TH_L3.6-W2.3-P5.00-D0.5]
C50  100nF  [CAP-TH_L3.6-W2.3-P5.00-D0.5]
C51  100nF  [CAP-TH_L3.6-W2.3-P5.00-D0.5]
C52  100nF  [CAP-TH_L3.6-W2.3-P5.00-D0.5]
C53  100nF  [CAP-TH_L3.6-W2.3-P5.00-D0.5]
C54  100nF  [CAP-TH_L3.6-W2.3-P5.00-D0.5]
C55  100nF  [CAP-TH_L3.6-W2.3-P5.00-D0.5]
C56  100nF  [CAP-TH_L3.6-W2.3-P5.00-D0.5]
C57  100nF  [CAP-TH_L3.6-W2.3-P5.00-D0.5]
J1  PCN10-64ACP-2.54DS_72_  [PCN1064ACP254DS72]
J2  PCN10-64ACP-2.54DS_72_  [PCN1064ACP254DS72]
sheet IMMEDIATE
DS9  LTA-1000HR  [DIPS762W50P254L2527H825Q20N]
IMM  SN74HC273N  [DIP-20_L26.8-W6.4-P2.54-LS7.6-BL]
R29  10KΩ  [RES-TH_BD2.3-L6.5-P10.50-D0.5]
R30  10KΩ  [RES-TH_BD2.3-L6.5-P10.50-D0.5]
R36  33Ω  [RES-TH_BD2.3-L6.5-P10.50-D0.5]
R37  33Ω  [RES-TH_BD2.3-L6.5-P10.50-D0.5]
RN17  4116R-1-102LF  [DIP787W49P254L2197H469Q16N]
RN18  4609H-101-103LF  [4609H101103LF]
RN19  4609H-101-103LF  [4609H101103LF]
RN20  4116R-1-330LF  [DIP787W49P254L2197H469Q16N]
RN21  4116R-1-330LF  [DIP787W49P254L2197H469Q16N]
U28  SN74HC00N  [DIP-14_L20.0-W7.6-P2.54-LS7.6-BL]
U29  SN74HC245N  [DIP-20_L26.8-W6.4-P2.54-LS7.6-BL]
U30  SN74HC245N  [DIP-20_L26.8-W6.4-P2.54-LS7.6-BL]
U31  SN74HC245N  [DIP-20_L26.8-W6.4-P2.54-LS7.6-BL]

## Library data of the parts
DIR0-DIR3 IMM IR = SN74HC273N: Supplier: LCSC; Manufacturer: TI; Supplier Part: C5238; JLCPCB Part Class: Extended Part
DM0-DM3 = SST39SF020A-70-4C-PHE: Supplier: LCSC; Supplier Part: C643681; Manufacturer: Microchip Tech; Contributor: LCSC; JLCPCB Part Class: Extended Part
DM0-A16-DM0-A18 DM1-A16-DM1-A18 DM2-A16-DM2-A18 DM3-A16-DM3-A18 = X6511WV-03H-C30D60: Supplier: LCSC; Supplier Part: C706875; Manufacturer: XKB Connectivity(中国星坤); Contributor: LCSC; JLCPCB Part Class: Extended Part
DS1-DS9 = LTA-1000HR: Contributor: bkastrup
R10-R13 R16-R28 R39-R42 = MF1/4W-2.2KΩ±1%T52: Supplier: LCSC; Supplier Part: C714002; Manufacturer: Huaxing Mechanical-Elec.; Contributor: LCSC; JLCPCB Part Class: Extended Part
RN1-RN3 RN6 RN10 RN12 RN14 RN16 RN18 RN19 = 4609H-101-103LF: Contributor: bkastrup
RN4 RN5 RN7-RN9 RN11 RN13 RN15 RN17 = 4116R-1-102LF: Contributor: bkastrup
U2-U7 U11-U14 U19-U27 U29-U31 = SN74HC245N: Supplier: LCSC; Manufacturer: TI; Supplier Part: C2899; JLCPCB Part Class: Extended Part
R7 R14 R15 R31-R37 = MF1/4W-1Ω±1%T52: Supplier: LCSC; Contributor: LCSC; Package Display: No
RN20-RN24 = 4116R-1-330LF: Contributor: bkastrup
9V-12V-DC = KLDX-0202-AP-LT: Contributor: bkastrup
C1 = EEUFR0J471B: Contributor: bkastrup; Package Display: No; Supplier: Mouser; Supplier Part: 647-UVY1C331MED1TD; Manufacturer: Nichicon
C2 = EEUFR0J471B: Contributor: bkastrup; Manufacturer Part: EEU-FR0J471B; Package Display: No; Supplier: Mouser; Supplier Part: 667-EEU-FR0J471B; Manufacturer: Panasonic
C3 C4 = K104M15X7RF5TH5: Supplier: LCSC; Supplier Part: C499573; Manufacturer: Vishay Intertech; Contributor: LCSC; Package Display: No
CLK RST = BTSA-N-P-0: Supplier: LCSC; Supplier Part: C2693689; Manufacturer: ROCPU(台普); Contributor: LCSC; JLCPCB Part Class: Extended Part
D1 = SA12CA-B: Supplier: LCSC; Supplier Part: C1666306; Manufacturer: Littelfuse(美国力特); link: https://atta.szlcsc.com/upload/public/pdf/source/20210601/0B3E4F854A384945BCD9F467CEEB89B0.pdf; Contributor: lcsc
D2 = 1N5818G: Supplier: LCSC; Supplier Part: C232462; Manufacturer: ON Semicon; Contributor: LCSC
D3 = SA5.0CA-E3/54: Supplier: LCSC; Supplier Part: C1973200; Manufacturer: VISHAY(威世); Contributor: LCSC; JLCPCB Part Class: Extended Part
IN-SYSTEM = 22-28-4020: Supplier: LCSC; Supplier Part: C234182; Manufacturer: MOLEX; Contributor: LCSC; JLCPCB Part Class: Extended Part; Package Display: No
ON = TJ-L3FYWGHRMFCSFLC2R-A5: Supplier: LCSC; Supplier Part: C331041; Manufacturer: TOGIALED; Contributor: LCSC
PWSW = 500SSP1S2M7QEA: Supplier: LCSC; Supplier Part: C273380; Manufacturer: E-Switch; Contributor: LCSC
R1-R5 R8 R9 R29 R30 R38 = MF1/4W-1Ω±1%T52: Supplier: LCSC; Supplier Part: C713947; Manufacturer: Huaxing Mechanical-Elec.; Contributor: LCSC
R6 = YR1B1K0CC: Supplier: LCSC; Supplier Part: C1364308; Manufacturer: TE Connectivity(美国泰科); JLCPCB Part Class: Extended Part; Contributor: lcsc
REG = TSR_1-2450: Contributor: bkastrup
S1-S3 = 2-5435668-8: Contributor: bkastrup
U1 U8 = SN74HC14N: Supplier: LCSC; Manufacturer: TI; Supplier Part: C2907; JLCPCB Part Class: Extended Part
U9 = SN74HC32N: Supplier: LCSC; Manufacturer: TI; Supplier Part: C2894; JLCPCB Part Class: Extended Part
U10 U15 U17 = SN74HC74N: Supplier: LCSC; Manufacturer: TI; Supplier Part: C2895; JLCPCB Part Class: Extended Part
PLA = ATF16V8C-7PU: Supplier: LCSC; Supplier Part: C613484; Manufacturer: MICROCHIP(美国微芯); Contributor: LCSC; JLCPCB Part Class: Extended Part
U16 U18 = SN74HC08N: Supplier: LCSC; Manufacturer: TI; Supplier Part: C2887; JLCPCB Part Class: Extended Part
U32 = SN74HC244N: Supplier: LCSC; Manufacturer: TI; Supplier Part: C2912; JLCPCB Part Class: Extended Part
C5-C14 = UHE1E101MED1TD: Supplier: LCSC; Manufacturer: Nichicon; Contributor: LCSC; Supplier Part: C116227
C15-C57 = K104M15X7RF5TH5: Supplier: LCSC; Supplier Part: C499573; Manufacturer: Vishay Intertech; Contributor: LCSC
J1 J2 = PCN10-64ACP-2.54DS_72_: Contributor: bkastrup
U28 = SN74HC00N: Supplier: LCSC; Manufacturer: TI(德州仪器); Supplier Part: C2902; JLCPCB Part Class: Extended Part

## Nets
GND: 9V-12V-DC.2 9V-12V-DC.3 C1.2(-) C2.2(-) C3.2 C4.2 C5.2 C6.2 C7.2 C8.2 C9.2 C10.2 C11.2 C12.2 C13.2 C14.2 C15.2 C16.2 C17.2 C18.2 C19.2 C20.2 C21.2 C22.2 C23.2 C24.2 C25.2 C26.2 C27.2 C28.2 C29.2 C30.2 C31.2 C32.2 C33.2 C34.2 C35.2 C36.2 C37.2 C38.2 C39.2 C40.2 C41.2 C42.2 C43.2 C44.2 C45.2 C46.2 C47.2 C48.2 C49.2 C50.2 C51.2 C52.2 C53.2 C54.2 C55.2 C56.2 C57.2 CLK.3 CLK.4 D1.1 D3.2(A) DIR0.10(GND) DIR1.10(GND) DIR2.10(GND) DIR3.10(GND) DM0.16(VSS) DM0.22(CE#) DM0.24(OE#) DM0-A16.1 DM0-A17.3 DM0-A18.1 DM1.16(VSS) DM1.22(CE#) DM1.24(OE#) DM1-A16.1 DM1-A17.3 DM1-A18.1 DM2.16(VSS) DM2.22(CE#) DM2.24(OE#) DM2-A16.1 DM2-A17.3 DM2-A18.1 DM3.16(VSS) DM3.22(CE#) DM3.24(OE#) DM3-A16.1 DM3-A17.3 DM3-A18.1 DS1.6(ANODE_F) DS1.7(ANODE_G) DS1.8(ANODE_H) DS1.9(ANODE_J) DS1.10(ANODE_K) DS1.11(CATHODE_K) DS1.12(CATHODE_J) DS1.13(CATHODE_H) DS1.14(CATHODE_G) DS1.15(CATHODE_F) DS1.16(CATHODE_E) DS1.17(CATHODE_D) DS1.18(CATHODE_C) DS1.19(CATHODE_B) DS1.20(CATHODE_A) DS2.1(ANODE_A) DS2.2(ANODE_B) DS2.11(CATHODE_K) DS2.12(CATHODE_J) DS2.13(CATHODE_H) DS2.14(CATHODE_G) DS2.15(CATHODE_F) DS2.16(CATHODE_E) DS2.17(CATHODE_D) DS2.18(CATHODE_C) DS2.19(CATHODE_B) DS2.20(CATHODE_A) DS3.7(ANODE_G) DS3.8(ANODE_H) DS3.9(ANODE_J) DS3.10(ANODE_K) DS3.11(CATHODE_K) DS3.12(CATHODE_J) DS3.13(CATHODE_H) DS3.14(CATHODE_G) DS3.15(CATHODE_F) DS3.16(CATHODE_E) DS3.17(CATHODE_D) DS3.18(CATHODE_C) DS3.19(CATHODE_B) DS3.20(CATHODE_A) DS4.1(ANODE_A) DS4.2(ANODE_B) DS4.11(CATHODE_K) DS4.12(CATHODE_J) DS4.13(CATHODE_H) DS4.14(CATHODE_G) DS4.15(CATHODE_F) DS4.16(CATHODE_E) DS4.17(CATHODE_D) DS4.18(CATHODE_C) DS4.19(CATHODE_B) DS4.20(CATHODE_A) DS5.9(ANODE_J) DS5.10(ANODE_K) DS5.11(CATHODE_K) DS5.12(CATHODE_J) DS5.13(CATHODE_H) DS5.14(CATHODE_G) DS5.15(CATHODE_F) DS5.16(CATHODE_E) DS5.17(CATHODE_D) DS5.18(CATHODE_C) DS5.19(CATHODE_B) DS5.20(CATHODE_A) DS6.9(ANODE_J) DS6.10(ANODE_K) DS6.11(CATHODE_K) DS6.12(CATHODE_J) DS6.13(CATHODE_H) DS6.14(CATHODE_G) DS6.15(CATHODE_F) DS6.16(CATHODE_E) DS6.17(CATHODE_D) DS6.18(CATHODE_C) DS6.19(CATHODE_B) DS6.20(CATHODE_A) DS7.9(ANODE_J) DS7.10(ANODE_K) DS7.11(CATHODE_K) DS7.12(CATHODE_J) DS7.13(CATHODE_H) DS7.14(CATHODE_G) DS7.15(CATHODE_F) DS7.16(CATHODE_E) DS7.17(CATHODE_D) DS7.18(CATHODE_C) DS7.19(CATHODE_B) DS7.20(CATHODE_A) DS8.9(ANODE_J) DS8.10(ANODE_K) DS8.11(CATHODE_K) DS8.12(CATHODE_J) DS8.13(CATHODE_H) DS8.14(CATHODE_G) DS8.15(CATHODE_F) DS8.16(CATHODE_E) DS8.17(CATHODE_D) DS8.18(CATHODE_C) DS8.19(CATHODE_B) DS8.20(CATHODE_A) DS9.9(ANODE_J) DS9.10(ANODE_K) DS9.11(CATHODE_K) DS9.12(CATHODE_J) DS9.13(CATHODE_H) DS9.14(CATHODE_G) DS9.15(CATHODE_F) DS9.16(CATHODE_E) DS9.17(CATHODE_D) DS9.18(CATHODE_C) DS9.19(CATHODE_B) DS9.20(CATHODE_A) IMM.10(GND) IN-SYSTEM.1 IR.10(GND) J1.C1 J1.C2 J1.C32 J1.MH1 J1.MH2 J2.A20 J2.A21 J2.A22 J2.A23 J2.C1 J2.C2 J2.C20 J2.C21 J2.C23 J2.C32 J2.MH1 J2.MH2 ON.2 PLA.1(I/CLK) PLA.10(GND) PLA.11(I9/OE#) PWSW.4 PWSW.5 REG.2(GND) RN1.1 RN2.1 RN3.1 RN5.14 RN5.15 RN5.16 RN6.1 RN7.7 RN7.8 RN10.1 RN12.1 RN14.1 RN16.1 RST.3 RST.4 U1.7(GND) U2.1(DIR) U2.10(GND) U2.16(B3) U2.17(B2) U2.18(B1) U3.1(DIR) U3.10(GND) U4.1(DIR) U4.10(GND) U4.16(B3) U4.17(B2) U4.18(B1) U5.1(DIR) U5.10(GND) U6.1(DIR) U6.10(GND) U6.16(B3) U6.17(B2) U6.18(B1) U6.19(OE#) U7.1(DIR) U7.10(GND) U7.19(OE#) U8.1(1A) U8.7(GND) U8.11(5A) U8.13(6A) U9.1(1A) U9.2(1B) U9.7(GND) U9.12(4A) U9.13(4B) U10.2(1D) U10.3(1CLK) U10.7(GND) U10.11(2CLK) U10.12(2D) U11.1(DIR) U11.10(GND) U12.1(DIR) U12.10(GND) U12.17(B2) U12.18(B1) U13.1(DIR) U13.10(GND) U13.17(B2) U13.18(B1) U14.1(DIR) U14.10(GND) U14.17(B2) U14.18(B1) U14.19(OE#) U15.7(GND) U16.7(GND) U17.1(1CLR#) U17.2(1D) U17.3(1CLK) U17.7(GND) U18.7(GND) U19.1(DIR) U19.10(GND) U19.19(OE#) U20.1(DIR) U20.10(GND) U20.19(OE#) U21.1(DIR) U21.10(GND) U22.1(DIR) U22.10(GND) U22.19(OE#) U23.1(DIR) U23.10(GND) U24.1(DIR) U24.10(GND) U24.19(OE#) U25.1(DIR) U25.10(GND) U26.1(DIR) U26.10(GND) U26.19(OE#) U27.1(DIR) U27.10(GND) U28.7(GND) U29.1(DIR) U29.10(GND) U30.1(DIR) U30.10(GND) U31.1(DIR) U31.10(GND) U31.19(OE#) U32.1(1OE#) U32.6(1A3) U32.10(GND) U32.11(2A1) U32.13(2A2) U32.15(2A3) U32.17(2A4)
VCC: C2.1(+) C5.1 C6.1 C7.1 C8.1 C9.1 C10.1 C11.1 C12.1 C13.1 C14.1 C15.1 C16.1 C17.1 C18.1 C19.1 C20.1 C21.1 C22.1 C23.1 C24.1 C25.1 C26.1 C27.1 C28.1 C29.1 C30.1 C31.1 C32.1 C33.1 C34.1 C35.1 C36.1 C37.1 C38.1 C39.1 C40.1 C41.1 C42.1 C43.1 C44.1 C45.1 C46.1 C47.1 C48.1 C49.1 C50.1 C51.1 C52.1 C53.1 C54.1 C55.1 C56.1 C57.1 D3.1(K) DIR0.20(VCC) DIR1.20(VCC) DIR2.20(VCC) DIR3.20(VCC) DM0.32(VDD) DM1.32(VDD) DM2.32(VDD) DM3.32(VDD) IMM.20(VCC) IR.20(VCC) PLA.20(VCC) R1.2 R2.2 R4.2 R6.1 R8.2 R9.1 R10.1 R11.2 R12.2 R13.2 R16.1 R17.1 R18.2 R19.1 R20.1 R21.2 R22.1 R23.1 R24.2 R25.1 R26.1 R27.2 R28.1 R29.2 R30.2 R38.2 R39.1 R40.1 R41.1 R42.1 REG.3(VOUT+) RN18.1 RN19.1 S1.1(1_1_COM) S1.2(2_1_COM) S1.3(3_1_COM) S1.4(4_1_COM) S1.5(5_1_COM) S1.6(6_1_COM) S1.7(7_1_COM) S1.8(8_1_COM) S2.1(1_1_COM) S2.2(2_1_COM) S2.3(3_1_COM) S2.4(4_1_COM) S2.5(5_1_COM) S2.6(6_1_COM) S2.7(7_1_COM) S2.8(8_1_COM) S3.1(1_1_COM) S3.2(2_1_COM) S3.3(3_1_COM) S3.4(4_1_COM) S3.5(5_1_COM) S3.6(6_1_COM) S3.7(7_1_COM) S3.8(8_1_COM) U1.14(VCC) U2.20(VCC) U3.20(VCC) U4.20(VCC) U5.20(VCC) U6.20(VCC) U7.20(VCC) U8.14(VCC) U9.14(VCC) U10.14(VCC) U11.20(VCC) U12.20(VCC) U13.20(VCC) U14.20(VCC) U15.14(VCC) U16.14(VCC) U17.14(VCC) U18.14(VCC) U19.20(VCC) U20.20(VCC) U21.20(VCC) U22.20(VCC) U23.20(VCC) U24.20(VCC) U25.20(VCC) U26.20(VCC) U27.20(VCC) U28.14(VCC) U29.20(VCC) U30.20(VCC) U31.20(VCC) U32.20(VCC)
AHLE: J1.C9 RN24.16
AHOE: J1.A7 RN24.15
ALLE: J1.C6 RN24.14
ALOE: J1.A4 RN24.13
AR1CE: J2.C30 RN24.12
AR1LE: J2.A28 RN24.11
AR1OE: J2.A29 RN24.10
AR2CE: J1.C4 RN24.9
AR2LE: J1.A3 RN23.16
AR2OE: J1.C3 RN23.15
BHLE: J1.A9 RN23.14
BHOE: J1.C8 RN23.13
BLLE: J1.A6 RN23.12
BLOE: J1.C5 RN23.11
BPOE: U1.4(2Y) U1.5(3A) U2.19(OE#) U3.19(OE#) U12.19(OE#)
BPVdd: J1.A1 J1.A2 J1.A31 J1.A32 J2.A1 J2.A2 J2.A31 J2.A32 PWSW.3
CFH: J1.A11 U12.11(B8)
CFL: J1.C11 U12.12(B7)
CIMF: RN16.4 U8.3(2A) U26.16(B3) U27.4(A3)
CLK: J2.C31 R14.1 U28.4(2A)
COMF: J2.C25 U2.14(B5)
DIR0: DIR0.2(1Q) U27.11(B8)
DIR1: DIR0.5(2Q) U27.12(B7)
DIR2: DIR0.6(3Q) U27.13(B6)
DIR3: DIR0.9(4Q) U27.14(B5)
DIR4: DIR0.12(5Q) U27.15(B4)
DIR5: DIR0.15(6Q) U27.16(B3)
DIR6: DIR0.16(7Q) U27.17(B2)
DIR7: DIR0.19(8Q) U27.18(B1)
DIR8: DIR1.2(1Q) U25.11(B8)
DIR9: DIR1.5(2Q) U25.12(B7)
DIR10: DIR1.6(3Q) U25.13(B6)
DIR11: DIR1.9(4Q) U25.14(B5)
DIR12: DIR1.12(5Q) U25.15(B4)
DIR13: DIR1.15(6Q) U25.16(B3)
DIR14: DIR1.16(7Q) U25.17(B2)
DIR15: DIR1.19(8Q) U25.18(B1)
DIR16: DIR2.2(1Q) U23.11(B8)
DIR17: DIR2.5(2Q) U23.12(B7)
DIR18: DIR2.6(3Q) U23.13(B6)
DIR19: DIR2.9(4Q) U23.14(B5)
DIR20: DIR2.12(5Q) U23.15(B4)
DIR21: DIR2.15(6Q) U23.16(B3)
DIR22: DIR2.16(7Q) U23.17(B2)
DIR23: DIR2.19(8Q) U23.18(B1)
DIR24: DIR3.2(1Q) U21.11(B8)
DIR25: DIR3.5(2Q) U21.12(B7)
DIR26: DIR3.6(3Q) U21.13(B6)
DIR27: DIR3.9(4Q) U21.14(B5)
DIR28: DIR3.12(5Q) U21.15(B4)
DIR29: DIR3.15(6Q) U21.16(B3)
DIR30: DIR3.16(7Q) U21.17(B2)
DIR31: DIR3.19(8Q) U21.18(B1)
EDBIE: J1.C7 RN23.10
FREE: J2.C24 R32.2
IBH0: J2.C6 RN20.16
IBH1: J2.A6 RN20.15
IBH2: J2.C5 RN20.14
IBH3: J2.A5 RN20.13
IBH4: J2.C4 RN20.12
IBH5: J2.A4 RN20.11
IBH6: J2.C3 RN20.10
IBH7: J2.A3 RN20.9
IBHIOE: J1.A8 RN23.9
IBL0: J2.C10 RN21.16
IBL1: J2.A10 RN21.15
IBL2: J2.C9 RN21.14
IBL3: J2.A9 RN21.13
IBL4: J2.C8 RN21.12
IBL5: J2.A8 RN21.11
IBL6: J2.C7 RN21.10
IBL7: J2.A7 RN21.9
IBLIOE: J1.A5 RN22.16
IMF: DM0.6(A6) DM1.6(A6) DM2.6(A6) DM3.6(A6) J2.A19 R34.2
IMMHOE: RN16.8 U26.12(B7) U27.8(A7) U28.12(4A) U28.13(4B)
IMMLOE: RN16.7 U26.13(B6) U27.7(A6) U28.9(3A) U28.10(3B)
IR0: DM0.27(A8) DM1.27(A8) DM2.27(A8) DM3.27(A8) IR.2(1Q) U19.18(B1)
IR1: DM0.26(A9) DM1.26(A9) DM2.26(A9) DM3.26(A9) IR.5(2Q) U19.17(B2)
IR2: DM0.23(A10) DM1.23(A10) DM2.23(A10) DM3.23(A10) IR.6(3Q) U19.16(B3)
IR3: DM0.25(A11) DM1.25(A11) DM2.25(A11) DM3.25(A11) IR.9(4Q) U19.15(B4)
IR4: DM0.4(A12) DM1.4(A12) DM2.4(A12) DM3.4(A12) IR.12(5Q) U19.14(B5)
IR5: DM0.28(A13) DM1.28(A13) DM2.28(A13) DM3.28(A13) IR.15(6Q) U19.13(B6)
IR6: DM0.29(A14) DM1.29(A14) DM2.29(A14) DM3.29(A14) IR.16(7Q) U19.12(B7)
IR7: DM0.3(A15) DM1.3(A15) DM2.3(A15) DM3.3(A15) IR.19(8Q) U19.11(B8)
JAHLE: J2.A26 RN22.15
JALLE: J2.A27 RN22.14
lCFH: DM0.7(A5) DM1.7(A5) DM2.7(A5) DM3.7(A5) U12.9(A8) U13.9(A8) U14.11(B8)
lCFL: DM0.8(A4) DM1.8(A4) DM2.8(A4) DM3.8(A4) U12.8(A7) U13.8(A7) U14.12(B7)
lCOMF: U2.6(A5) U4.6(A5) U6.14(B5) U9.9(3A)
lnHLT: U2.7(A6) U4.7(A6) U6.13(B6) U15.12(2D)
lnRST: DIR0.1(CLR#) DIR1.1(CLR#) DIR2.1(CLR#) DIR3.1(CLR#) IMM.1(CLR#) IR.1(CLR#) U2.8(A7) U4.8(A7) U6.12(B7) U9.5(2B) U9.10(3B) U15.4(1PRE#) U15.13(2CLR#) U16.1(1A) U16.2(1B) U17.13(2CLR#)
lnSYSCLK: U8.8(4Y) U15.3(1CLK) U16.12(4A)
lOPIMM0: IMM.3(1D) PLA.9(I8) U3.9(A8) U5.2(A1) U7.18(B1) U11.18(B1)
lOPIMM1: IMM.4(2D) PLA.8(I7) U3.8(A7) U5.3(A2) U7.17(B2) U11.17(B2)
lOPIMM2: IMM.7(3D) PLA.7(I6) U3.7(A6) U5.4(A3) U7.16(B3) U11.16(B3)
lOPIMM3: IMM.8(4D) PLA.6(I5) U3.6(A5) U5.5(A4) U7.15(B4) U11.15(B4)
lOPIMM4: IMM.13(5D) PLA.5(I4) U3.5(A4) U5.6(A5) U7.14(B5) U11.14(B5)
lOPIMM5: IMM.14(6D) PLA.4(I3) U3.4(A3) U5.7(A6) U7.13(B6) U11.13(B6)
lOPIMM6: IMM.17(7D) PLA.3(I2) U3.3(A2) U5.8(A7) U7.12(B7) U11.12(B7)
lOPIMM7: IMM.18(8D) PLA.2(I1) U3.2(A1) U5.9(A8) U7.11(B8) U11.11(B8)
lSFH: DM0.9(A3) DM1.9(A3) DM2.9(A3) DM3.9(A3) U12.7(A6) U13.7(A6) U14.13(B6)
lSFL: DM0.10(A2) DM1.10(A2) DM2.10(A2) DM3.10(A2) U12.6(A5) U13.6(A5) U14.14(B5)
lSIMF: U2.5(A4) U4.5(A4) U6.15(B4) U10.4(1PRE#)
lSYSCLK: R7.1 U8.9(4A) U15.11(2CLK) U16.10(3B)
lZFH: DM0.11(A1) DM1.11(A1) DM2.11(A1) DM3.11(A1) U12.5(A4) U13.5(A4) U14.15(B4)
lZFL: DM0.12(A0) DM1.12(A0) DM2.12(A0) DM3.12(A0) U12.4(A3) U13.4(A3) U14.16(B3)
nCLK: DIR0.11(CLK) DIR1.11(CLK) DIR2.11(CLK) DIR3.11(CLK) IMM.11(CLK) IR.11(CLK) R15.1 U17.11(2CLK)
nDIROE: U15.5(1Q) U21.19(OE#) U23.19(OE#) U25.19(OE#) U27.19(OE#)
nHLT: J2.C26 U2.13(B6)
nNOPOE: U11.19(OE#) U18.6(2Y)
nRD: J2.C27 R36.1
nRST: J2.A30 U2.12(B7)
nWR: J2.A25 R37.2
OMF: DM0.5(A7) DM1.5(A7) DM2.5(A7) DM3.5(A7) J2.C19 R33.1
OPIMM0: J2.C15 U3.11(B8)
OPIMM1: J2.A15 U3.12(B7)
OPIMM2: J2.C16 U3.13(B6)
OPIMM3: J2.A16 U3.14(B5)
OPIMM4: J2.C17 U3.15(B4)
OPIMM5: J2.A17 U3.16(B3)
OPIMM6: J2.C18 U3.17(B2)
OPIMM7: J2.A18 U3.18(B1)
PCLE: J2.C28 RN22.13
PCOE: J2.C29 R35.2
RD: RN16.6 U26.14(B5) U27.6(A5) U28.1(1A) U28.2(1B)
RHOE: J1.C13 RN22.12
RLOE: J1.C14 RN22.11
SFH: J1.A12 U12.13(B6)
SFL: J1.C12 U12.14(B5)
SFW: J1.A14 RN22.10
SIMF: J2.A24 U2.15(B4)
SNH: J1.A13 RN22.9
SNL: J1.C15 R31.2
SOMF: RN16.3 U8.5(3A) U26.17(B2) U27.3(A2)
SWOE: U1.6(3Y) U4.19(OE#) U5.19(OE#) U13.19(OE#)
SYSCLK: J2.C22 U2.11(B8)
WR: RN16.5 U26.15(B4) U27.5(A4) U28.5(2B)
ZFH: J1.A10 U12.15(B4)
ZFL: J1.C10 U12.16(B3)
Net-(9V-12V-DC-1): 9V-12V-DC.1 D1.2 D2.2(A)
Net-(C1-1): C1.1(+) PWSW.2 REG.1(VIN+)
Net-(C3-1): C3.1 R3.1 U1.13(6A)
Net-(C4-1): C4.1 R5.1 U1.9(4A)
Net-(CLK-1): CLK.1 CLK.2 R2.1 R3.2
Net-(D2-1): D2.1(C) PWSW.1
Net-(DIR0-3): DIR0.3(1D) DM0.13(DQ0)
Net-(DIR0-4): DIR0.4(2D) DM0.14(DQ1)
Net-(DIR0-7): DIR0.7(3D) DM0.15(DQ2)
Net-(DIR0-8): DIR0.8(4D) DM0.17(DQ3)
Net-(DIR0-13): DIR0.13(5D) DM0.18(DQ4)
Net-(DIR0-14): DIR0.14(6D) DM0.19(DQ5)
Net-(DIR0-17): DIR0.17(7D) DM0.20(DQ6)
Net-(DIR0-18): DIR0.18(8D) DM0.21(DQ7)
Net-(DIR1-3): DIR1.3(1D) DM1.13(DQ0)
Net-(DIR1-4): DIR1.4(2D) DM1.14(DQ1)
Net-(DIR1-7): DIR1.7(3D) DM1.15(DQ2)
Net-(DIR1-8): DIR1.8(4D) DM1.17(DQ3)
Net-(DIR1-13): DIR1.13(5D) DM1.18(DQ4)
Net-(DIR1-14): DIR1.14(6D) DM1.19(DQ5)
Net-(DIR1-17): DIR1.17(7D) DM1.20(DQ6)
Net-(DIR1-18): DIR1.18(8D) DM1.21(DQ7)
Net-(DIR2-3): DIR2.3(1D) DM2.13(DQ0)
Net-(DIR2-4): DIR2.4(2D) DM2.14(DQ1)
Net-(DIR2-7): DIR2.7(3D) DM2.15(DQ2)
Net-(DIR2-8): DIR2.8(4D) DM2.17(DQ3)
Net-(DIR2-13): DIR2.13(5D) DM2.18(DQ4)
Net-(DIR2-14): DIR2.14(6D) DM2.19(DQ5)
Net-(DIR2-17): DIR2.17(7D) DM2.20(DQ6)
Net-(DIR2-18): DIR2.18(8D) DM2.21(DQ7)
Net-(DIR3-3): DIR3.3(1D) DM3.13(DQ0)
Net-(DIR3-4): DIR3.4(2D) DM3.14(DQ1)
Net-(DIR3-7): DIR3.7(3D) DM3.15(DQ2)
Net-(DIR3-8): DIR3.8(4D) DM3.17(DQ3)
Net-(DIR3-13): DIR3.13(5D) DM3.18(DQ4)
Net-(DIR3-14): DIR3.14(6D) DM3.19(DQ5)
Net-(DIR3-17): DIR3.17(7D) DM3.20(DQ6)
Net-(DIR3-18): DIR3.18(8D) DM3.21(DQ7)
Net-(DM0-1): DM0.1(NC) DM0-A18.2
Net-(DM0-2): DM0.2(A16) DM0-A16.2
Net-(DM0-30): DM0.30(A17) DM0-A17.2
Net-(DM0-31): DM0.31(WE#) R28.2
Net-(DM0-A16-3): DM0-A16.3 R26.2
Net-(DM0-A17-1): DM0-A17.1 R27.1
Net-(DM0-A18-3): DM0-A18.3 R42.2
Net-(DM1-1): DM1.1(NC) DM1-A18.2
Net-(DM1-2): DM1.2(A16) DM1-A16.2
Net-(DM1-30): DM1.30(A17) DM1-A17.2
Net-(DM1-31): DM1.31(WE#) R25.2
Net-(DM1-A16-3): DM1-A16.3 R23.2
Net-(DM1-A17-1): DM1-A17.1 R24.1
Net-(DM1-A18-3): DM1-A18.3 R41.2
Net-(DM2-1): DM2.1(NC) DM2-A18.2
Net-(DM2-2): DM2.2(A16) DM2-A16.2
Net-(DM2-30): DM2.30(A17) DM2-A17.2
Net-(DM2-31): DM2.31(WE#) R22.2
Net-(DM2-A16-3): DM2-A16.3 R20.2
Net-(DM2-A17-1): DM2-A17.1 R21.1
Net-(DM2-A18-3): DM2-A18.3 R40.2
Net-(DM3-1): DM3.1(NC) DM3-A18.2
Net-(DM3-2): DM3.2(A16) DM3-A16.2
Net-(DM3-30): DM3.30(A17) DM3-A17.2
Net-(DM3-31): DM3.31(WE#) R19.2
Net-(DM3-A16-3): DM3-A16.3 R17.2
Net-(DM3-A17-1): DM3-A17.1 R18.1
Net-(DM3-A18-3): DM3-A18.3 R39.2
Net-(DS1-1): DS1.1(ANODE_A) RN5.8
Net-(DS1-2): DS1.2(ANODE_B) RN5.7
Net-(DS1-3): DS1.3(ANODE_C) RN5.6
Net-(DS1-4): DS1.4(ANODE_D) RN5.5
Net-(DS1-5): DS1.5(ANODE_E) RN5.4
Net-(DS2-3): DS2.3(ANODE_C) RN4.16
Net-(DS2-4): DS2.4(ANODE_D) RN4.15
Net-(DS2-5): DS2.5(ANODE_E) RN4.14
Net-(DS2-6): DS2.6(ANODE_F) RN4.13
Net-(DS2-7): DS2.7(ANODE_G) RN4.12
Net-(DS2-8): DS2.8(ANODE_H) RN4.11
Net-(DS2-9): DS2.9(ANODE_J) RN4.10
Net-(DS2-10): DS2.10(ANODE_K) RN4.9
Net-(DS3-1): DS3.1(ANODE_A) RN7.16
Net-(DS3-2): DS3.2(ANODE_B) RN7.15
Net-(DS3-3): DS3.3(ANODE_C) RN7.14
Net-(DS3-4): DS3.4(ANODE_D) RN7.13
Net-(DS3-5): DS3.5(ANODE_E) RN7.12
Net-(DS3-6): DS3.6(ANODE_F) RN7.11
Net-(DS4-3): DS4.3(ANODE_C) RN8.16
Net-(DS4-4): DS4.4(ANODE_D) RN8.15
Net-(DS4-5): DS4.5(ANODE_E) RN8.14
Net-(DS4-6): DS4.6(ANODE_F) RN8.13
Net-(DS4-7): DS4.7(ANODE_G) RN8.12
Net-(DS4-8): DS4.8(ANODE_H) RN8.11
Net-(DS4-9): DS4.9(ANODE_J) RN8.10
Net-(DS4-10): DS4.10(ANODE_K) RN8.9
Net-(DS5-1): DS5.1(ANODE_A) RN9.16
Net-(DS5-2): DS5.2(ANODE_B) RN9.15
Net-(DS5-3): DS5.3(ANODE_C) RN9.14
Net-(DS5-4): DS5.4(ANODE_D) RN9.13
Net-(DS5-5): DS5.5(ANODE_E) RN9.12
Net-(DS5-6): DS5.6(ANODE_F) RN9.11
Net-(DS5-7): DS5.7(ANODE_G) RN9.10
Net-(DS5-8): DS5.8(ANODE_H) RN9.9
Net-(DS6-1): DS6.1(ANODE_A) RN11.16
Net-(DS6-2): DS6.2(ANODE_B) RN11.15
Net-(DS6-3): DS6.3(ANODE_C) RN11.14
Net-(DS6-4): DS6.4(ANODE_D) RN11.13
Net-(DS6-5): DS6.5(ANODE_E) RN11.12
Net-(DS6-6): DS6.6(ANODE_F) RN11.11
Net-(DS6-7): DS6.7(ANODE_G) RN11.10
Net-(DS6-8): DS6.8(ANODE_H) RN11.9
Net-(DS7-1): DS7.1(ANODE_A) RN13.16
Net-(DS7-2): DS7.2(ANODE_B) RN13.15
Net-(DS7-3): DS7.3(ANODE_C) RN13.14
Net-(DS7-4): DS7.4(ANODE_D) RN13.13
Net-(DS7-5): DS7.5(ANODE_E) RN13.12
Net-(DS7-6): DS7.6(ANODE_F) RN13.11
Net-(DS7-7): DS7.7(ANODE_G) RN13.10
Net-(DS7-8): DS7.8(ANODE_H) RN13.9
Net-(DS8-1): DS8.1(ANODE_A) RN15.16
Net-(DS8-2): DS8.2(ANODE_B) RN15.15
Net-(DS8-3): DS8.3(ANODE_C) RN15.14
Net-(DS8-4): DS8.4(ANODE_D) RN15.13
Net-(DS8-5): DS8.5(ANODE_E) RN15.12
Net-(DS8-6): DS8.6(ANODE_F) RN15.11
Net-(DS8-7): DS8.7(ANODE_G) RN15.10
Net-(DS8-8): DS8.8(ANODE_H) RN15.9
Net-(DS9-1): DS9.1(ANODE_A) RN17.16
Net-(DS9-2): DS9.2(ANODE_B) RN17.15
Net-(DS9-3): DS9.3(ANODE_C) RN17.14
Net-(DS9-4): DS9.4(ANODE_D) RN17.13
Net-(DS9-5): DS9.5(ANODE_E) RN17.12
Net-(DS9-6): DS9.6(ANODE_F) RN17.11
Net-(DS9-7): DS9.7(ANODE_G) RN17.10
Net-(DS9-8): DS9.8(ANODE_H) RN17.9
Net-(IMM-2): IMM.2(1Q) U29.11(B8) U30.11(B8) U31.11(B8)
Net-(IMM-5): IMM.5(2Q) U29.12(B7) U30.12(B7) U31.12(B7)
Net-(IMM-6): IMM.6(3Q) U29.13(B6) U30.13(B6) U31.13(B6)
Net-(IMM-9): IMM.9(4Q) U29.14(B5) U30.14(B5) U31.14(B5)
Net-(IMM-12): IMM.12(5Q) U29.15(B4) U30.15(B4) U31.15(B4)
Net-(IMM-15): IMM.15(6Q) U29.16(B3) U30.16(B3) U31.16(B3)
Net-(IMM-16): IMM.16(7Q) U29.17(B2) U30.17(B2) U31.17(B2)
Net-(IMM-19): IMM.19(8Q) U29.18(B1) U30.18(B1) U31.18(B1)
Net-(IN-SYSTEM-2): IN-SYSTEM.2 R1.1 U1.1(1A)
Net-(IR-3): IR.3(1D) RN1.9 U11.2(A1)
Net-(IR-4): IR.4(2D) RN1.8 U11.3(A2)
Net-(IR-7): IR.7(3D) RN1.7 U11.4(A3)
Net-(IR-8): IR.8(4D) RN1.6 U11.5(A4)
Net-(IR-13): IR.13(5D) RN1.5 U11.6(A5)
Net-(IR-14): IR.14(6D) RN1.4 U11.7(A6)
Net-(IR-17): IR.17(7D) RN1.3 U11.8(A7)
Net-(IR-18): IR.18(8D) RN1.2 U11.9(A8)
Net-(ON-1): ON.1 R6.2
Net-(PLA-12): PLA.12(I/O) U18.12(4A)
Net-(R4-1): R4.1 R5.2 RST.1 RST.2
Net-(R7-2): R7.2 U2.9(A8) U4.9(A8) U6.11(B8)
Net-(R8-1): R8.1 R33.2 U10.9(2Q)
Net-(R9-2): R9.2 R34.1 U10.5(1Q)
Net-(R10-2): R10.2 U17.10(2PRE#)
Net-(R11-1): R11.1 U17.4(1PRE#)
Net-(R12-1): R12.1 U15.10(2PRE#)
Net-(R13-1): R13.1 U15.1(1CLR#)
Net-(R14-2): R14.2 U32.16(1Y2)
Net-(R15-2): R15.2 U32.18(1Y1)
Net-(R16-2): R16.2 U32.19(2OE#)
Net-(R29-1): R29.1 R36.2 U28.3(1Y)
Net-(R30-1): R30.1 R37.1 U28.6(2Y)
Net-(R31-1): R31.1 RN16.9 U26.11(B8) U27.9(A8)
Net-(R32-1): R32.1 RN16.2 U26.18(B1) U27.2(A1)
Net-(R35-1): R35.1 R38.1 U32.12(1Y4)
Net-(RN2-2): RN2.2 S2.9(1_2_NO) U5.11(B8)
Net-(RN2-3): RN2.3 S2.10(2_2_NO) U5.12(B7)
Net-(RN2-4): RN2.4 S2.11(3_2_NO) U5.13(B6)
Net-(RN2-5): RN2.5 S2.12(4_2_NO) U5.14(B5)
Net-(RN2-6): RN2.6 S2.13(5_2_NO) U5.15(B4)
Net-(RN2-7): RN2.7 S2.14(6_2_NO) U5.16(B3)
Net-(RN2-8): RN2.8 S2.15(7_2_NO) U5.17(B2)
Net-(RN2-9): RN2.9 S2.16(8_2_NO) U5.18(B1)
Net-(RN3-2): RN3.2 S1.9(1_2_NO) U4.13(B6)
Net-(RN3-3): RN3.3 S1.10(2_2_NO) U4.14(B5)
Net-(RN3-4): RN3.4 S1.11(3_2_NO) U4.15(B4)
Net-(RN4-1): RN4.1 U7.9(A8)
Net-(RN4-2): RN4.2 U7.8(A7)
Net-(RN4-3): RN4.3 U7.7(A6)
Net-(RN4-4): RN4.4 U7.6(A5)
Net-(RN4-5): RN4.5 U7.5(A4)
Net-(RN4-6): RN4.6 U7.4(A3)
Net-(RN4-7): RN4.7 U7.3(A2)
Net-(RN4-8): RN4.8 U7.2(A1)
Net-(RN5-9): RN5.9 U6.9(A8)
Net-(RN5-10): RN5.10 U6.8(A7)
Net-(RN5-11): RN5.11 U6.7(A6)
Net-(RN5-12): RN5.12 U6.6(A5)
Net-(RN5-13): RN5.13 U6.5(A4)
Net-(RN6-2): RN6.2 S3.9(1_2_NO) U13.11(B8)
Net-(RN6-3): RN6.3 S3.10(2_2_NO) U13.12(B7)
Net-(RN6-4): RN6.4 S3.11(3_2_NO) U13.13(B6)
Net-(RN6-5): RN6.5 S3.12(4_2_NO) U13.14(B5)
Net-(RN6-6): RN6.6 S3.13(5_2_NO) U13.15(B4)
Net-(RN6-7): RN6.7 S3.14(6_2_NO) U13.16(B3)
Net-(RN7-1): RN7.1 U14.9(A8)
Net-(RN7-2): RN7.2 U14.8(A7)
Net-(RN7-3): RN7.3 U14.7(A6)
Net-(RN7-4): RN7.4 U14.6(A5)
Net-(RN7-5): RN7.5 U14.5(A4)
Net-(RN7-6): RN7.6 U14.4(A3)
Net-(RN8-1): RN8.1 U19.9(A8)
Net-(RN8-2): RN8.2 U19.8(A7)
Net-(RN8-3): RN8.3 U19.7(A6)
Net-(RN8-4): RN8.4 U19.6(A5)
Net-(RN8-5): RN8.5 U19.5(A4)
Net-(RN8-6): RN8.6 U19.4(A3)
Net-(RN8-7): RN8.7 U19.3(A2)
Net-(RN8-8): RN8.8 U19.2(A1)
Net-(RN9-1): RN9.1 U20.9(A8)
Net-(RN9-2): RN9.2 U20.8(A7)
Net-(RN9-3): RN9.3 U20.7(A6)
Net-(RN9-4): RN9.4 U20.6(A5)
Net-(RN9-5): RN9.5 U20.5(A4)
Net-(RN9-6): RN9.6 U20.4(A3)
Net-(RN9-7): RN9.7 U20.3(A2)
Net-(RN9-8): RN9.8 U20.2(A1)
Net-(RN10-2): RN10.2 RN24.8 U20.18(B1) U21.2(A1)
Net-(RN10-3): RN10.3 RN24.7 U20.17(B2) U21.3(A2)
Net-(RN10-4): RN10.4 RN24.6 U20.16(B3) U21.4(A3)
Net-(RN10-5): RN10.5 RN24.5 U20.15(B4) U21.5(A4)
Net-(RN10-6): RN10.6 RN24.4 U20.14(B5) U21.6(A5)
Net-(RN10-7): RN10.7 RN24.3 U20.13(B6) U21.7(A6)
Net-(RN10-8): RN10.8 RN24.2 U20.12(B7) U21.8(A7)
Net-(RN10-9): RN10.9 RN24.1 U20.11(B8) U21.9(A8)
Net-(RN11-1): RN11.1 U22.9(A8)
Net-(RN11-2): RN11.2 U22.8(A7)
Net-(RN11-3): RN11.3 U22.7(A6)
Net-(RN11-4): RN11.4 U22.6(A5)
Net-(RN11-5): RN11.5 U22.5(A4)
Net-(RN11-6): RN11.6 U22.4(A3)
Net-(RN11-7): RN11.7 U22.3(A2)
Net-(RN11-8): RN11.8 U22.2(A1)
Net-(RN12-2): RN12.2 RN23.8 U22.18(B1) U23.2(A1)
Net-(RN12-3): RN12.3 RN23.7 U22.17(B2) U23.3(A2)
Net-(RN12-4): RN12.4 RN23.6 U22.16(B3) U23.4(A3)
Net-(RN12-5): RN12.5 RN23.5 U22.15(B4) U23.5(A4)
Net-(RN12-6): RN12.6 RN23.4 U22.14(B5) U23.6(A5)
Net-(RN12-7): RN12.7 RN23.3 U22.13(B6) U23.7(A6)
Net-(RN12-8): RN12.8 RN23.2 U22.12(B7) U23.8(A7)
Net-(RN12-9): RN12.9 RN23.1 U22.11(B8) U23.9(A8)
Net-(RN13-1): RN13.1 U24.9(A8)
Net-(RN13-2): RN13.2 U24.8(A7)
Net-(RN13-3): RN13.3 U24.7(A6)
Net-(RN13-4): RN13.4 U24.6(A5)
Net-(RN13-5): RN13.5 U24.5(A4)
Net-(RN13-6): RN13.6 U24.4(A3)
Net-(RN13-7): RN13.7 U24.3(A2)
Net-(RN13-8): RN13.8 U24.2(A1)
Net-(RN14-2): RN14.2 RN22.8 U24.18(B1) U25.2(A1)
Net-(RN14-3): RN14.3 RN22.7 U24.17(B2) U25.3(A2)
Net-(RN14-4): RN14.4 RN22.6 U24.16(B3) U25.4(A3)
Net-(RN14-5): RN14.5 RN22.5 U24.15(B4) U25.5(A4)
Net-(RN14-6): RN14.6 RN22.4 U24.14(B5) U25.6(A5)
Net-(RN14-7): RN14.7 RN22.3 U24.13(B6) U25.7(A6)
Net-(RN14-8): RN14.8 RN22.2 U24.12(B7) U25.8(A7)
Net-(RN14-9): RN14.9 RN22.1 U24.11(B8) U25.9(A8)
Net-(RN15-1): RN15.1 U26.9(A8)
Net-(RN15-2): RN15.2 U26.8(A7)
Net-(RN15-3): RN15.3 U26.7(A6)
Net-(RN15-4): RN15.4 U26.6(A5)
Net-(RN15-5): RN15.5 U26.5(A4)
Net-(RN15-6): RN15.6 U26.4(A3)
Net-(RN15-7): RN15.7 U26.3(A2)
Net-(RN15-8): RN15.8 U26.2(A1)
Net-(RN17-1): RN17.1 U31.9(A8)
Net-(RN17-2): RN17.2 U31.8(A7)
Net-(RN17-3): RN17.3 U31.7(A6)
Net-(RN17-4): RN17.4 U31.6(A5)
Net-(RN17-5): RN17.5 U31.5(A4)
Net-(RN17-6): RN17.6 U31.4(A3)
Net-(RN17-7): RN17.7 U31.3(A2)
Net-(RN17-8): RN17.8 U31.2(A1)
Net-(RN18-2): RN18.2 RN20.8 U29.2(A1)
Net-(RN18-3): RN18.3 RN20.7 U29.3(A2)
Net-(RN18-4): RN18.4 RN20.6 U29.4(A3)
Net-(RN18-5): RN18.5 RN20.5 U29.5(A4)
Net-(RN18-6): RN18.6 RN20.4 U29.6(A5)
Net-(RN18-7): RN18.7 RN20.3 U29.7(A6)
Net-(RN18-8): RN18.8 RN20.2 U29.8(A7)
Net-(RN18-9): RN18.9 RN20.1 U29.9(A8)
Net-(RN19-2): RN19.2 RN21.8 U30.2(A1)
Net-(RN19-3): RN19.3 RN21.7 U30.3(A2)
Net-(RN19-4): RN19.4 RN21.6 U30.4(A3)
Net-(RN19-5): RN19.5 RN21.5 U30.5(A4)
Net-(RN19-6): RN19.6 RN21.4 U30.6(A5)
Net-(RN19-7): RN19.7 RN21.3 U30.7(A6)
Net-(RN19-8): RN19.8 RN21.2 U30.8(A7)
Net-(RN19-9): RN19.9 RN21.1 U30.9(A8)
Net-(U1-2): U1.2(1Y) U1.3(2A)
Net-(U1-8): U1.8(4Y) U4.12(B7)
Net-(U1-10): U1.10(5Y) U4.11(B8)
Net-(U1-11): U1.11(5A) U1.12(6Y)
Net-(U8-4): U8.4(2Y) U9.4(2A)
Net-(U8-6): U8.6(3Y) U10.10(2PRE#)
Net-(U9-6): U9.6(2Y) U10.1(1CLR#)
Net-(U9-8): U9.8(3Y) U10.13(2CLR#)
Net-(U15-2): U15.2(1D) U15.8(2Q#)
Net-(U15-6): U15.6(1Q#) U16.9(3A)
Net-(U15-9): U15.9(2Q) U16.13(4B)
Net-(U16-3): U16.3(1Y) U16.4(2A) U16.5(2B)
Net-(U16-6): U16.6(2Y) U32.8(1A4)
Net-(U16-8): U16.8(3Y) U32.4(1A2)
Net-(U16-11): U16.11(4Y) U32.2(1A1)
Net-(U17-8): U17.8(2Q#) U18.13(4B)
Net-(U17-9): U17.9(2Q) U18.9(3A) U18.10(3B)
Net-(U17-12): U17.12(2D) U18.11(4Y)
Net-(U18-1): U18.1(1A) U18.2(1B) U18.8(3Y)
Net-(U18-3): U18.3(1Y) U18.4(2A) U18.5(2B)
Net-(U28-8): U28.8(3Y) U30.19(OE#)
Net-(U28-11): U28.11(4Y) U29.19(OE#)

Not connected (* = marked no-connect by the designer): J1 A15* A16* A17* A18* A19* A20* A21* A22* A23* A24* A25* A26* A27* A28* A29* A30* C16* C17* C18* C19* C20* C21* C22* C23* C24* C25* C26* C27* C28* C29* C30* C31*; J2 A11* A12* A13* A14* C11* C12* C13* C14*; PLA 13(I/O)* 14(I/O)* 15(I/O)* 16(I/O)* 17(I/O)* 18(I/O)* 19(I/O)*; RN3 5* 6* 7* 8* 9*; RN5 1* 2* 3*; RN6 8* 9*; RN7 9* 10*; S1 12(4_2_NO)* 13(5_2_NO)* 14(6_2_NO)* 15(7_2_NO)* 16(8_2_NO)*; S3 15(7_2_NO)* 16(8_2_NO)*; U2 2(A1)* 3(A2)* 4(A3)*; U4 2(A1)* 3(A2)* 4(A3)*; U6 2(A1)* 3(A2)* 4(A3)*; U8 2(1Y)* 10(5Y)* 12(6Y)*; U9 3(1Y)* 11(4Y)*; U10 6(1Q#)* 8(2Q#)*; U12 2(A1)* 3(A2)*; U13 2(A1)* 3(A2)*; U14 2(A1)* 3(A2)*; U17 5(1Q)* 6(1Q#)*; U32 3(2Y4)* 5(2Y3)* 7(2Y2)* 9(2Y1)* 14(1Y3)*
